# EAGLE design FLC-148 LED & Keypad panel (EAGLE 9.4.0)
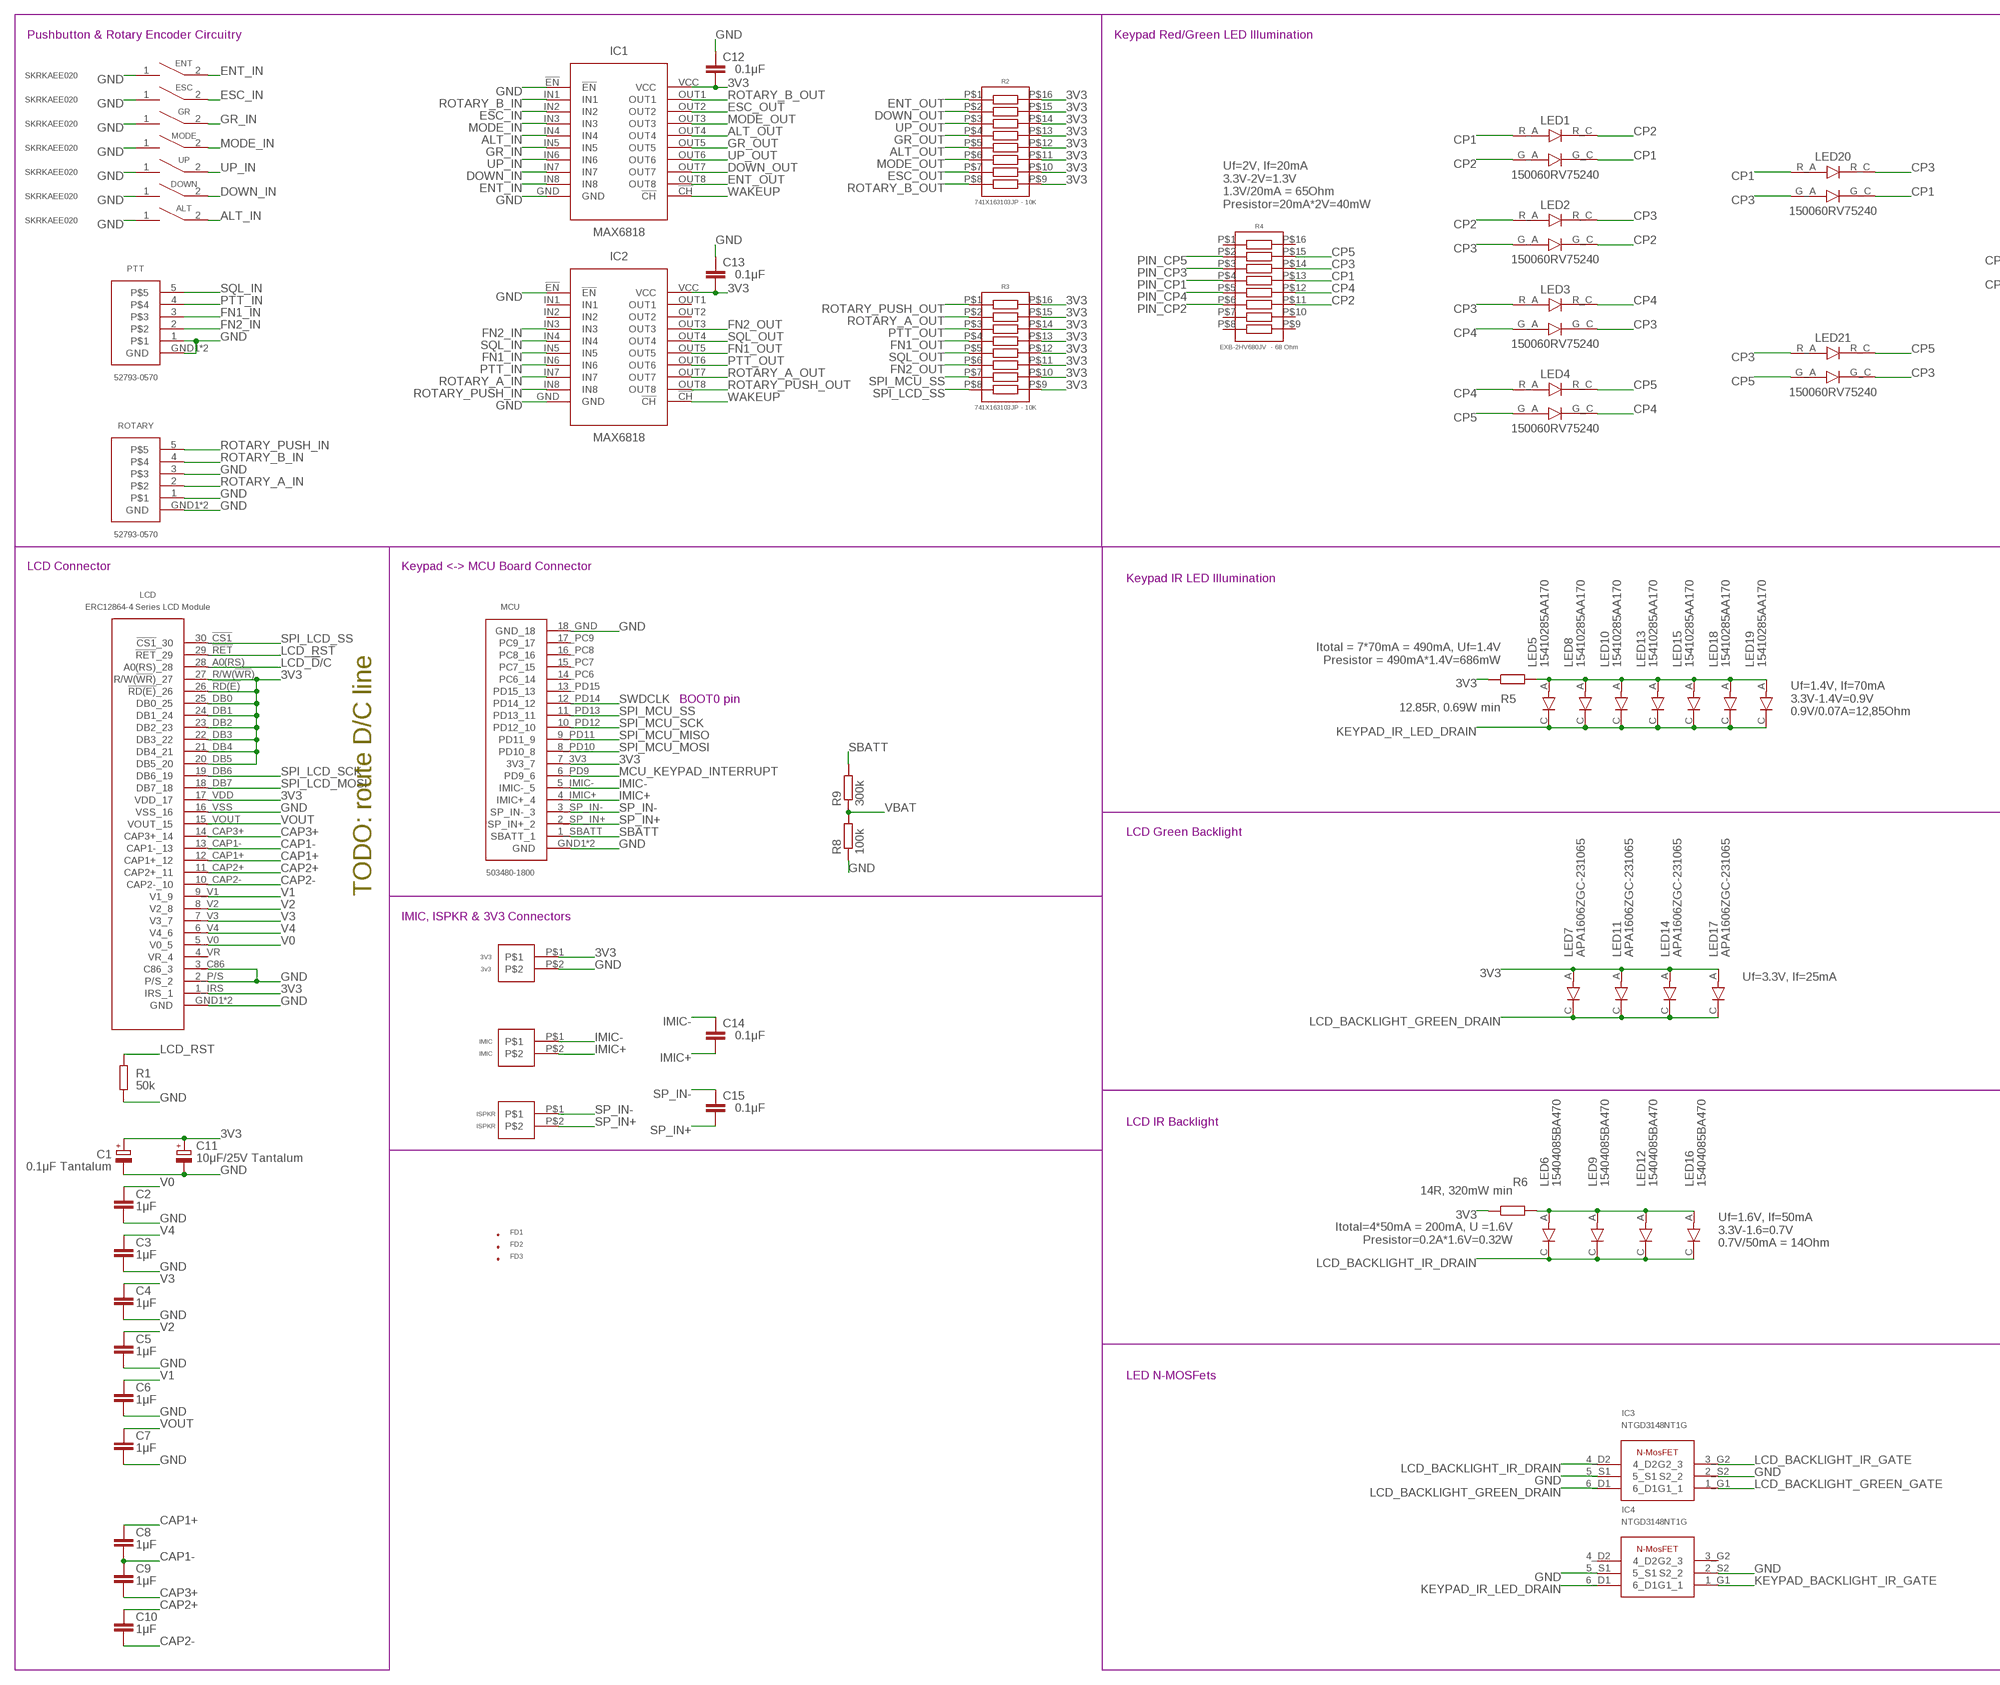
[diagram p0: schematic, sheet 1, part 1 of 2]
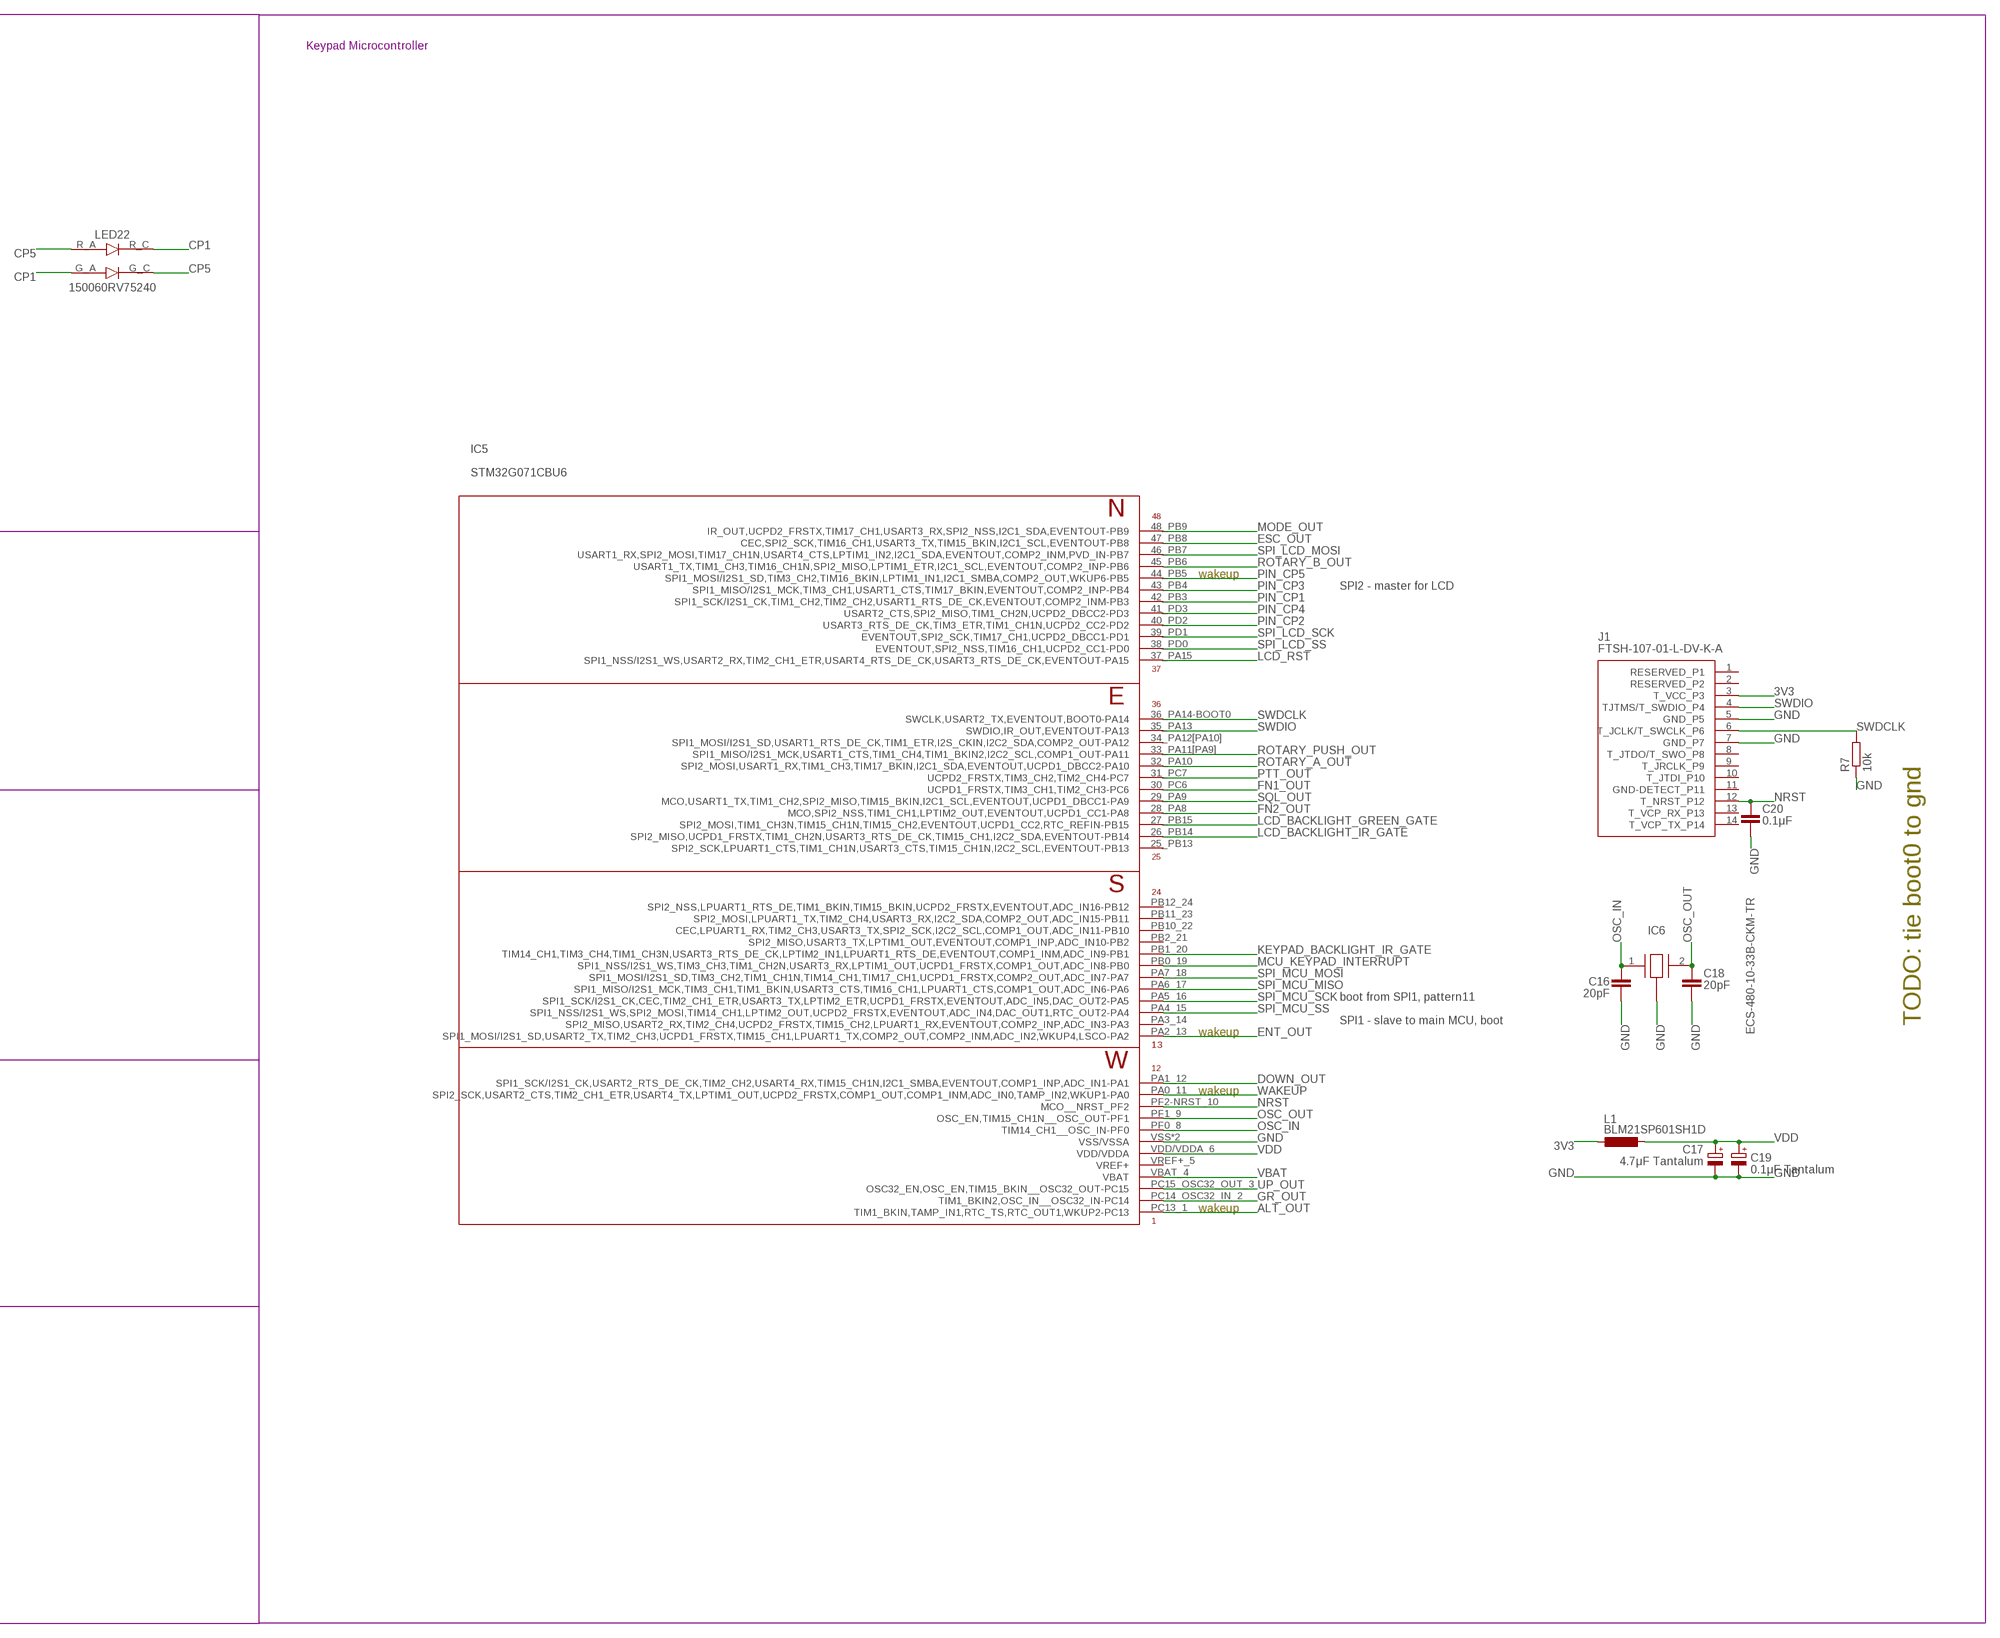
[diagram p1: schematic, sheet 1, part 2 of 2]

## Parts
3V3  3v3  2POLE_CONNECTOR  [SMD]
ALT  SKRKAEE020  [SMD]
C1  0.1μF Tantalum  CPOL-EUSMCA  [SMC_A]
C2  1μF  C-EUC0402  [C0402]
C3  1μF  C-EUC0402  [C0402]
C4  1μF  C-EUC0402  [C0402]
C5  1μF  C-EUC0402  [C0402]
C6  1μF  C-EUC0402  [C0402]
C7  1μF  C-EUC0402  [C0402]
C8  1μF  C-EUC0402  [C0402]
C9  1μF  C-EUC0402  [C0402]
C10  1μF  C-EUC0402  [C0402]
C11  10μF/25V Tantalum  CPOL-EUSMCB  [SMC_B]
C12  0.1μF  C-EUC0402  [C0402]
C13  0.1μF  C-EUC0402  [C0402]
C14  0.1μF  C-EUC0402  [C0402]
C15  0.1μF  C-EUC0402  [C0402]
C16  20pF  C-EUC0402  [C0402]
C17  4.7μF Tantalum  CPOL-EUSMCA  [SMC_A]
C18  20pF  C-EUC0402  [C0402]
C19  0.1μF Tantalum  CPOL-EUSMCA  [SMC_A]
C20  0.1μF  C-EUC0402  [C0402]
DOWN  SKRKAEE020  [SMD]
ENT  SKRKAEE020  [SMD]
ESC  SKRKAEE020  [SMD]
FD1  FID_20MIL_P  [FID_020_P]
FD2  FID_20MIL_P  [FID_020_P]
FD3  FID_20MIL_P  [FID_020_P]
GR  SKRKAEE020  [SMD]
IC1  MAX6818  [TSSOP20]
IC2  MAX6818  [TSSOP20]
IC3  NTGD3148NT1G  [TSOP-6]
IC4  NTGD3148NT1G  [TSOP-6]
IC5  STM32G071CBU6  [UFQFPN48]
IC6  ECS-480-10-33B-CKM-TR  [3.2X2.5MM]
IMIC  IMIC  2POLE_CONNECTOR  [SMD]
ISPKR  ISPKR  2POLE_CONNECTOR  [SMD]
J1  FTSH-107-01-L-DV-K-A  [FTSH10701LDVKA]
L1  BLM21SP601SH1D  L-EUL2012C  [L2012C]
LCD  ERC12864-4 Series LCD Module  ER-CON30HB-1  [SMD]
LED1  150060RV75240  WL-SBCC  [SMD]
LED2  150060RV75240  WL-SBCC  [SMD]
LED3  150060RV75240  WL-SBCC  [SMD]
LED4  150060RV75240  WL-SBCC  [SMD]
LED5  15410285AA170  [1002]
LED6  15404085BA470  [0402]
LED7  APA1606ZGC-231065  APA1606ZGC  [0605]
LED8  15410285AA170  [1002]
LED9  15404085BA470  [0402]
LED10  15410285AA170  [1002]
LED11  APA1606ZGC-231065  APA1606ZGC  [0605]
LED12  15404085BA470  [0402]
LED13  15410285AA170  [1002]
LED14  APA1606ZGC-231065  APA1606ZGC  [0605]
LED15  15410285AA170  [1002]
LED16  15404085BA470  [0402]
LED17  APA1606ZGC-231065  APA1606ZGC  [0605]
LED18  15410285AA170  [1002]
LED19  15410285AA170  [1002]
LED20  150060RV75240  WL-SBCC  [SMD]
LED21  150060RV75240  WL-SBCC  [SMD]
LED22  150060RV75240  WL-SBCC  [SMD]
MCU  503480-1800  5034801800-MOTHERBOARD<->LCD-PANEL  [5034801800-MOTHERBOARD<->LCD-PANEL]
MODE  SKRKAEE020  [SMD]
PTT  52793-0570  527930570  [SMD]
R1  50k  R-EU_R0402  [R0402]
R2  741X163103JP - 10K  741X163  [SMD]
R3  741X163103JP - 10K  741X163  [SMD]
R4  EXB-2HV680JV - 68 Ohm  741X163  [SMD]
R5  12.85R, 0.69W min  R-EU_R1206  [R1206]
R6  14R, 320mW min  R-EU_R0805  [R0805]
R7  10k  R-EU_R0402  [R0402]
R8  100k  R-EU_R0402  [R0402]
R9  300k  R-EU_R0402  [R0402]
ROTARY  52793-0570  527930570  [SMD]
UP  SKRKAEE020  [SMD]

## Nets
3V3 [Vcc]: 3V3.P$1 C1.+ C11.+ C12.2 C13.2 IC1.VCC IC2.VCC J1.3(T_VCC_P3) L1.2 LCD.1_IRS(IRS_1) LCD.17_VDD(VDD_17) LCD.20_DB5(DB5_20) LCD.21_DB4(DB4_21) LCD.22_DB3(DB3_22) LCD.23_DB2(DB2_23) LCD.24_DB1(DB1_24) LCD.25_DB0(DB0_25) LCD.26_!RD(E)!(!RD(E)!_26) LCD.27_R/W(!WR!)(R/W(!WR!)_27) LED7.A LED11.A LED14.A LED17.A MCU.7_3V3(3V3_7) R2.P$9 R2.P$10 R2.P$11 R2.P$12 R2.P$13 R2.P$14 R2.P$15 R2.P$16 R3.P$9 R3.P$10 R3.P$11 R3.P$12 R3.P$13 R3.P$14 R3.P$15 R3.P$16 R5.1 R6.1
ALT_IN [signal]: ALT.2 IC1.IN4
ALT_OUT [signal]: IC1.OUT4 IC5.PC13_1(TIM1_BKIN,TAMP_IN1,RTC_TS,RTC_OUT1,WKUP2-PC13) R2.P$5
CAP1+ [signal]: C8.1 LCD.12_CAP1+(CAP1+_12)
CAP1- [signal]: C8.2 C9.1 LCD.13_CAP1-(CAP1-_13)
CAP2+ [signal]: C10.1 LCD.11_CAP2+(CAP2+_11)
CAP2- [signal]: C10.2 LCD.10_CAP2-(CAP2-_10)
CAP3+ [signal]: C9.2 LCD.14_CAP3+(CAP3+_14)
CP1 [signal]: LED1.G_C LED1.R_A LED20.G_C LED20.R_A LED22.G_A LED22.R_C R4.P$13
CP2 [signal]: LED1.G_A LED1.R_C LED2.G_C LED2.R_A R4.P$11
CP3 [signal]: LED2.G_A LED2.R_C LED3.G_C LED3.R_A LED20.G_A LED20.R_C LED21.G_C LED21.R_A R4.P$14
CP4 [signal]: LED3.G_A LED3.R_C LED4.G_C LED4.R_A R4.P$12
CP5 [signal]: LED4.G_A LED4.R_C LED21.G_A LED21.R_C LED22.G_C LED22.R_A R4.P$15
DOWN_IN [signal]: DOWN.2 IC1.IN7
DOWN_OUT [signal]: IC1.OUT7 IC5.PA1_12(SPI1_SCK/I2S1_CK,USART2_RTS_DE_CK,TIM2_CH2,USART4_RX,TIM15_CH1N,I2C1_SMBA,EVENTOUT,COMP1_INP,ADC_IN1-PA1) R2.P$2
ENT_IN [signal]: ENT.2 IC1.IN8
ENT_OUT [signal]: IC1.OUT8 IC5.PA2_13(SPI1_MOSI/I2S1_SD,USART2_TX,TIM2_CH3,UCPD1_FRSTX,TIM15_CH1,LPUART1_TX,COMP2_OUT,COMP2_INM,ADC_IN2,WKUP4,LSCO-PA2) R2.P$1
ESC_IN [signal]: ESC.2 IC1.IN2
ESC_OUT [signal]: IC1.OUT2 IC5.47_PB8(CEC,SPI2_SCK,TIM16_CH1,USART3_TX,TIM15_BKIN,I2C1_SCL,EVENTOUT-PB8) R2.P$7
FN1_IN [signal]: IC2.IN5 PTT.3
FN1_OUT [signal]: IC2.OUT5 IC5.30_PC6(UCPD1_FRSTX,TIM3_CH1,TIM2_CH3-PC6) R3.P$4
FN2_IN [signal]: IC2.IN3 PTT.2
FN2_OUT [signal]: IC2.OUT3 IC5.28_PA8(MCO,SPI2_NSS,TIM1_CH1,LPTIM2_OUT,EVENTOUT,UCPD1_CC1-PA8) R3.P$6
GND: 3V3.P$2 ALT.1 C1.- C2.2 C3.2 C4.2 C5.2 C6.2 C7.2 C11.- C12.1 C13.1 C16.2 C17.- C18.2 C19.- C20.2 DOWN.1 ENT.1 ESC.1 GR.1 IC1.!EN! IC1.GND IC2.!EN! IC2.GND IC3.2_S2(S2_2) IC3.5_S1 IC4.2_S2(S2_2) IC4.5_S1 IC5.VSS(VSS/VSSA) IC5.VSS/VSSA_7(VSS/VSSA) IC6.GND1(GND) IC6.GND2(GND) J1.5(GND_P5) J1.7(GND_P7) LCD.2_P/S(P/S_2) LCD.3_C86(C86_3) LCD.16_VSS(VSS_16) LCD.GND1(GND) LCD.GND2(GND) MCU.18_GND(GND_18) MCU.GND1(GND) MCU.GND2(GND) MODE.1 PTT.1 PTT.GND1(GND) PTT.GND2(GND) R1.1 R7.1 R8.1 ROTARY.1 ROTARY.3 ROTARY.GND1(GND) ROTARY.GND2(GND) UP.1
GR_IN [signal]: GR.2 IC1.IN5
GR_OUT [signal]: IC1.OUT5 IC5.PC14_OSC32_IN_2(TIM1_BKIN2,OSC_IN__OSC32_IN-PC14) R2.P$4
IMIC+ [signal]: C14.2 IMIC.P$2 MCU.4_IMIC+(IMIC+_4)
IMIC- [signal]: C14.1 IMIC.P$1 MCU.5_IMIC-(IMIC-_5)
IR_ANODE [signal]: LED6.A LED9.A LED12.A LED16.A R6.2
KEYPAD_BACKLIGHT_IR_GATE [signal]: IC4.1_G1(G1_1) IC5.PB1_20(TIM14_CH1,TIM3_CH4,TIM1_CH3N,USART3_RTS_DE_CK,LPTIM2_IN1,LPUART1_RTS_DE,EVENTOUT,COMP1_INM,ADC_IN9-PB1)
KEYPAD_IR_LED_A [signal]: LED5.A LED8.A LED10.A LED13.A LED15.A LED18.A LED19.A R5.2
KEYPAD_IR_LED_DRAIN [signal]: IC4.6_D1 LED5.C LED8.C LED10.C LED13.C LED15.C LED18.C LED19.C
LCD_!D!/C [signal]: LCD.28_A0(RS)(A0(RS)_28)
LCD_BACKLIGHT_GREEN_DRAIN [signal]: IC3.6_D1 LED7.C LED11.C LED14.C LED17.C
LCD_BACKLIGHT_GREEN_GATE [signal]: IC3.1_G1(G1_1) IC5.27_PB15(SPI2_MOSI,TIM1_CH3N,TIM15_CH1N,TIM15_CH2,EVENTOUT,UCPD1_CC2,RTC_REFIN-PB15)
LCD_BACKLIGHT_IR_DRAIN [signal]: IC3.4_D2 LED6.C LED9.C LED12.C LED16.C
LCD_BACKLIGHT_IR_GATE [signal]: IC3.3_G2(G2_3) IC5.26_PB14(SPI2_MISO,UCPD1_FRSTX,TIM1_CH2N,USART3_RTS_DE_CK,TIM15_CH1,I2C2_SDA,EVENTOUT-PB14)
LCD_RST [signal]: IC5.37_PA15(SPI1_NSS/I2S1_WS,USART2_RX,TIM2_CH1_ETR,USART4_RTS_DE_CK,USART3_RTS_DE_CK,EVENTOUT-PA15) LCD.29_!RET!(!RET!_29) R1.2
MCU_KEYPAD_INTERRUPT [signal]: IC5.PB0_19(SPI1_NSS/I2S1_WS,TIM3_CH3,TIM1_CH2N,USART3_RX,LPTIM1_OUT,UCPD1_FRSTX,COMP1_OUT,ADC_IN8-PB0) MCU.6_PD9(PD9_6)
MODE_IN [signal]: IC1.IN3 MODE.2
MODE_OUT [signal]: IC1.OUT3 IC5.48_PB9(IR_OUT,UCPD2_FRSTX,TIM17_CH1,USART3_RX,SPI2_NSS,I2C1_SDA,EVENTOUT-PB9) R2.P$6
NRST [signal]: C20.1 IC5.PF2-NRST_10(MCO__NRST_PF2) J1.12(T_NRST_P12)
OSC_IN [signal]: C16.1 IC5.PF0_8(TIM14_CH1__OSC_IN-PF0) IC6.1
OSC_OUT [signal]: C18.1 IC5.PF1_9(OSC_EN,TIM15_CH1N__OSC_OUT-PF1) IC6.2
PIN_CP1 [signal]: IC5.42_PB3(SPI1_SCK/I2S1_CK,TIM1_CH2,TIM2_CH2,USART1_RTS_DE_CK,EVENTOUT,COMP2_INM-PB3) R4.P$4
PIN_CP2 [signal]: IC5.40_PD2(USART3_RTS_DE_CK,TIM3_ETR,TIM1_CH1N,UCPD2_CC2-PD2) R4.P$6
PIN_CP3 [signal]: IC5.43_PB4(SPI1_MISO/I2S1_MCK,TIM3_CH1,USART1_CTS,TIM17_BKIN,EVENTOUT,COMP2_INP-PB4) R4.P$3
PIN_CP4 [signal]: IC5.41_PD3(USART2_CTS,SPI2_MISO,TIM1_CH2N,UCPD2_DBCC2-PD3) R4.P$5
PIN_CP5 [signal]: IC5.44_PB5(SPI1_MOSI/I2S1_SD,TIM3_CH2,TIM16_BKIN,LPTIM1_IN1,I2C1_SMBA,COMP2_OUT,WKUP6-PB5) R4.P$2
PTT_IN [signal]: IC2.IN6 PTT.4
PTT_OUT [signal]: IC2.OUT6 IC5.31_PC7(UCPD2_FRSTX,TIM3_CH2,TIM2_CH4-PC7) R3.P$3
ROTARY_A_IN [signal]: IC2.IN7 ROTARY.2
ROTARY_A_OUT [signal]: IC2.OUT7 IC5.32_PA10(SPI2_MOSI,USART1_RX,TIM1_CH3,TIM17_BKIN,I2C1_SDA,EVENTOUT,UCPD1_DBCC2-PA10) R3.P$2
ROTARY_B_IN [signal]: IC1.IN1 ROTARY.4
ROTARY_B_OUT [signal]: IC1.OUT1 IC5.45_PB6(USART1_TX,TIM1_CH3,TIM16_CH1N,SPI2_MISO,LPTIM1_ETR,I2C1_SCL,EVENTOUT,COMP2_INP-PB6) R2.P$8
ROTARY_PUSH_IN [signal]: IC2.IN8 ROTARY.5
ROTARY_PUSH_OUT [signal]: IC2.OUT8 IC5.33_PA11[PA9](SPI1_MISO/I2S1_MCK,USART1_CTS,TIM1_CH4,TIM1_BKIN2,I2C2_SCL,COMP1_OUT-PA11) R3.P$1
SBATT [Vcc]: MCU.1_SBATT(SBATT_1) R9.2
SP_IN+ [signal]: C15.2 ISPKR.P$2 MCU.2_SP_IN+(SP_IN+_2)
SP_IN- [signal]: C15.1 ISPKR.P$1 MCU.3_SP_IN-(SP_IN-_3)
SPI_LCD_MOSI [signal]: IC5.46_PB7(USART1_RX,SPI2_MOSI,TIM17_CH1N,USART4_CTS,LPTIM1_IN2,I2C1_SDA,EVENTOUT,COMP2_INM,PVD_IN-PB7) LCD.18_DB7(DB7_18)
SPI_LCD_SCK [signal]: IC5.39_PD1(EVENTOUT,SPI2_SCK,TIM17_CH1,UCPD2_DBCC1-PD1) LCD.19_DB6(DB6_19)
SPI_LCD_SS [signal]: IC5.38_PD0(EVENTOUT,SPI2_NSS,TIM16_CH1,UCPD2_CC1-PD0) LCD.30_!CS1!(!CS1!_30) R3.P$8
SPI_MCU_MISO [signal]: IC5.PA6_17(SPI1_MISO/I2S1_MCK,TIM3_CH1,TIM1_BKIN,USART3_CTS,TIM16_CH1,LPUART1_CTS,COMP1_OUT,ADC_IN6-PA6) MCU.9_PD11(PD11_9)
SPI_MCU_MOSI [signal]: IC5.PA7_18(SPI1_MOSI/I2S1_SD,TIM3_CH2,TIM1_CH1N,TIM14_CH1,TIM17_CH1,UCPD1_FRSTX,COMP2_OUT,ADC_IN7-PA7) MCU.8_PD10(PD10_8)
SPI_MCU_SCK [signal]: IC5.PA5_16(SPI1_SCK/I2S1_CK,CEC,TIM2_CH1_ETR,USART3_TX,LPTIM2_ETR,UCPD1_FRSTX,EVENTOUT,ADC_IN5,DAC_OUT2-PA5) MCU.10_PD12(PD12_10)
SPI_MCU_SS [signal]: IC5.PA4_15(SPI1_NSS/I2S1_WS,SPI2_MOSI,TIM14_CH1,LPTIM2_OUT,UCPD2_FRSTX,EVENTOUT,ADC_IN4,DAC_OUT1,RTC_OUT2-PA4) MCU.11_PD13(PD13_11) R3.P$7
SQL_IN [signal]: IC2.IN4 PTT.5
SQL_OUT [signal]: IC2.OUT4 IC5.29_PA9(MCO,USART1_TX,TIM1_CH2,SPI2_MISO,TIM15_BKIN,I2C1_SCL,EVENTOUT,UCPD1_DBCC1-PA9) R3.P$5
SWDCLK [signal]: IC5.36_PA14-BOOT0(SWCLK,USART2_TX,EVENTOUT,BOOT0-PA14) J1.6(T_JCLK/T_SWCLK_P6) MCU.12_PD14(PD14_12) R7.2
SWDIO [signal]: IC5.35_PA13(SWDIO,IR_OUT,EVENTOUT-PA13) J1.4(TJTMS/T_SWDIO_P4)
UP_IN [signal]: IC1.IN6 UP.2
UP_OUT [signal]: IC1.OUT6 IC5.PC15_OSC32_OUT_3(OSC32_EN,OSC_EN,TIM15_BKIN__OSC32_OUT-PC15) R2.P$3
V0 [signal]: C2.1 LCD.5_V0(V0_5)
V1 [signal]: C6.1 LCD.9_V1(V1_9)
V2 [signal]: C5.1 LCD.8_V2(V2_8)
V3 [signal]: C4.1 LCD.7_V3(V3_7)
V4 [signal]: C3.1 LCD.6_V4(V4_6)
VBAT: IC5.VBAT_4(VBAT) R8.2 R9.1
VDD [Vcc]: C17.+ C19.+ IC5.VDD/VDDA_6(VDD/VDDA) L1.1
VOUT [signal]: C7.1 LCD.15_VOUT(VOUT_15)
WAKEUP [signal]: IC1.!CH! IC2.!CH! IC5.PA0_11(SPI2_SCK,USART2_CTS,TIM2_CH1_ETR,USART4_TX,LPTIM1_OUT,UCPD2_FRSTX,COMP1_OUT,COMP1_INM,ADC_IN0,TAMP_IN2,WKUP1-PA0)
Unconnected: IC2.IN1 IC2.IN2 IC2.OUT1 IC2.OUT2 IC4.3_G2(G2_3) IC4.4_D2 IC5.25_PB13(SPI2_SCK,LPUART1_CTS,TIM1_CH1N,USART3_CTS,TIM15_CH1N,I2C2_SCL,EVENTOUT-PB13) IC5.34_PA12[PA10](SPI1_MOSI/I2S1_SD,USART1_RTS_DE_CK,TIM1_ETR,I2S_CKIN,I2C2_SDA,COMP2_OUT-PA12) IC5.PA3_14(SPI2_MISO,USART2_RX,TIM2_CH4,UCPD2_FRSTX,TIM15_CH2,LPUART1_RX,EVENTOUT,COMP2_INP,ADC_IN3-PA3) IC5.PB2_21(SPI2_MISO,USART3_TX,LPTIM1_OUT,EVENTOUT,COMP1_INP,ADC_IN10-PB2) IC5.PB10_22(CEC,LPUART1_RX,TIM2_CH3,USART3_TX,SPI2_SCK,I2C2_SCL,COMP1_OUT,ADC_IN11-PB10) IC5.PB11_23(SPI2_MOSI,LPUART1_TX,TIM2_CH4,USART3_RX,I2C2_SDA,COMP2_OUT,ADC_IN15-PB11) IC5.PB12_24(SPI2_NSS,LPUART1_RTS_DE,TIM1_BKIN,TIM15_BKIN,UCPD2_FRSTX,EVENTOUT,ADC_IN16-PB12) IC5.VREF+_5(VREF+) J1.1(RESERVED_P1) J1.2(RESERVED_P2) J1.8(T_JTDO/T_SWO_P8) J1.9(T_JRCLK_P9) J1.10(T_JTDI_P10) J1.11(GND-DETECT_P11) J1.13(T_VCP_RX_P13) J1.14(T_VCP_TX_P14) LCD.4_VR(VR_4) MCU.13_PD15(PD15_13) MCU.14_PC6(PC6_14) MCU.15_PC7(PC7_15) MCU.16_PC8(PC8_16) MCU.17_PC9(PC9_17) R4.P$1 R4.P$7 R4.P$8 R4.P$9 R4.P$10 R4.P$16

## Notes on the sheet
- Pushbutton & Rotary Encoder Circuitry | Keypad Red/Green LED Illumination
- Keypad Microcontroller
- Uf=2V, If=20mA
  3.3V-2V=1.3V
  1.3V/20mA = 65Ohm
  Presistor=20mA*2V=40mW
- LCD Connector | Keypad <-> MCU Board Connector
- Keypad IR LED Illumination
- wakeup
- SPI2 - master for LCD
- Itotal = 7*70mA = 490mA, Uf=1.4V
  Presistor = 490mA*1.4V=686mW
- TODO: route D/C line
- BOOT0 pin
- Uf=1.4V, If=70mA
  3.3V-1.4V=0.9V
  0.9V/0.07A=12,85Ohm
- TODO: tie boot0 to gnd
- LCD Green Backlight
- IMIC, ISPKR & 3V3 Connectors
- Uf=3.3V, If=25mA
- boot from SPI1, pattern11
- SPI1 - slave to main MCU, boot
- wakeup
- LCD IR Backlight | wakeup
- Itotal=4*50mA = 200mA, U =1.6V
  Presistor=0.2A*1.6V=0.32W
- Uf=1.6V, If=50mA
  3.3V-1.6=0.7V
  0.7V/50mA = 14Ohm
- wakeup
- LED N-MOSFets

## Library data of the parts
3V3 IMIC ISPKR = 2-Pole Connector:2POLE_CONNECTOR
ALT DOWN ENT ESC GR MODE UP = SKRKAEE020 TACT Pushbutton:SKRKAEE020
C1 C11 C17 C19 = rcl:CPOL-EU: POLARIZED CAPACITOR, European symbol; SPICEPREFIX: C
C2-C10 C12-C16 C18 C20 = rcl:C-EU: CAPACITOR, European symbol; SPICEPREFIX: C
FD1-FD3 = Fiducial:FID: Fiducial marks. Top and Bottom copper with stop mask
IC1 IC2 = MAX6818 CMOS Switch debouncer:MAX6818
IC3 IC4 = NTGD3148NT1G - dual N-Fet:NTGD3148NT1G
IC5 = STM32G071CBU6 Microcontroller:STM32G071CBU6
IC6 = ECS-480-10-33B-CKM-TR 48MHz Crystal:ECS-480-10-33B-CKM-TR
J1 = STM32 JTAG 1.27mm 14pin header:FTSH-107-01-L-DV-K-A: Headers & Wire Housings .050" Micro Terminal Strip Source: Datasheet <https://componentsearchengine.com/Datasheets/1/FTSH-107-01-L-DV-K-A.pdf>; DESCRIPTION: Headers & Wire Housings .050" Micro Terminal Strip; HEIGHT: 5.97mm; MANUFACTURER_NAME: SAMTEC; MANUFACTURER_PART_NUMBER: FTSH-107-01-L-DV-K-A; MOUSER_PART_NUMBER: 200-FTSH10701LDVKA; MOUSER_PRICE-STOCK: https://www.mouser.com/Search/Refine.aspx?Keyword=200-FTSH10701LDVKA
L1 = rcl:L-EU: INDUCTOR, European symbol; SPICEPREFIX: L
LCD = ER-CON30HB-1 FFC Connector 30p 0.5mm Pitch.pdf:ER-CON30HB-1
LED1-LED4 LED20-LED22 = 150060RV75240 WL-SBCC Bi-Color LED:WL-SBCC
LED5 LED8 LED10 LED13 LED15 LED18 LED19 = 15410285AA170 IR LED:15410285AA170
LED6 LED9 LED12 LED16 = 15404085BA470 IR LED:15404085BA470
LED7 LED11 LED14 LED17 = APA1606ZGC Green LED:APA1606ZGC
MCU = 5034801800 FFC Connector 19p 0.5mm Pitch, FLC148 Motherboard - LCD Panel:5034801800-MOTHERBOARD<->LCD-PANEL
PTT ROTARY = 527930570 FFC Connector 5p 1mm Pitch:527930570
R1 R5-R9 = rcl:R-EU_: RESISTOR, European symbol; SPICEPREFIX: R
R2-R4 = 741X163103JP 10k Ohm Resistor Array:741X163

## Net classes
0 GND: width 0.3 mm, drill 0.35 mm, clearance 0.2 mm
1 Vcc: width 0.3 mm, drill 0.35 mm, clearance 0.2 mm
2 signal: width 0.25 mm, drill 0.35 mm, clearance 0.2 mm

## Board
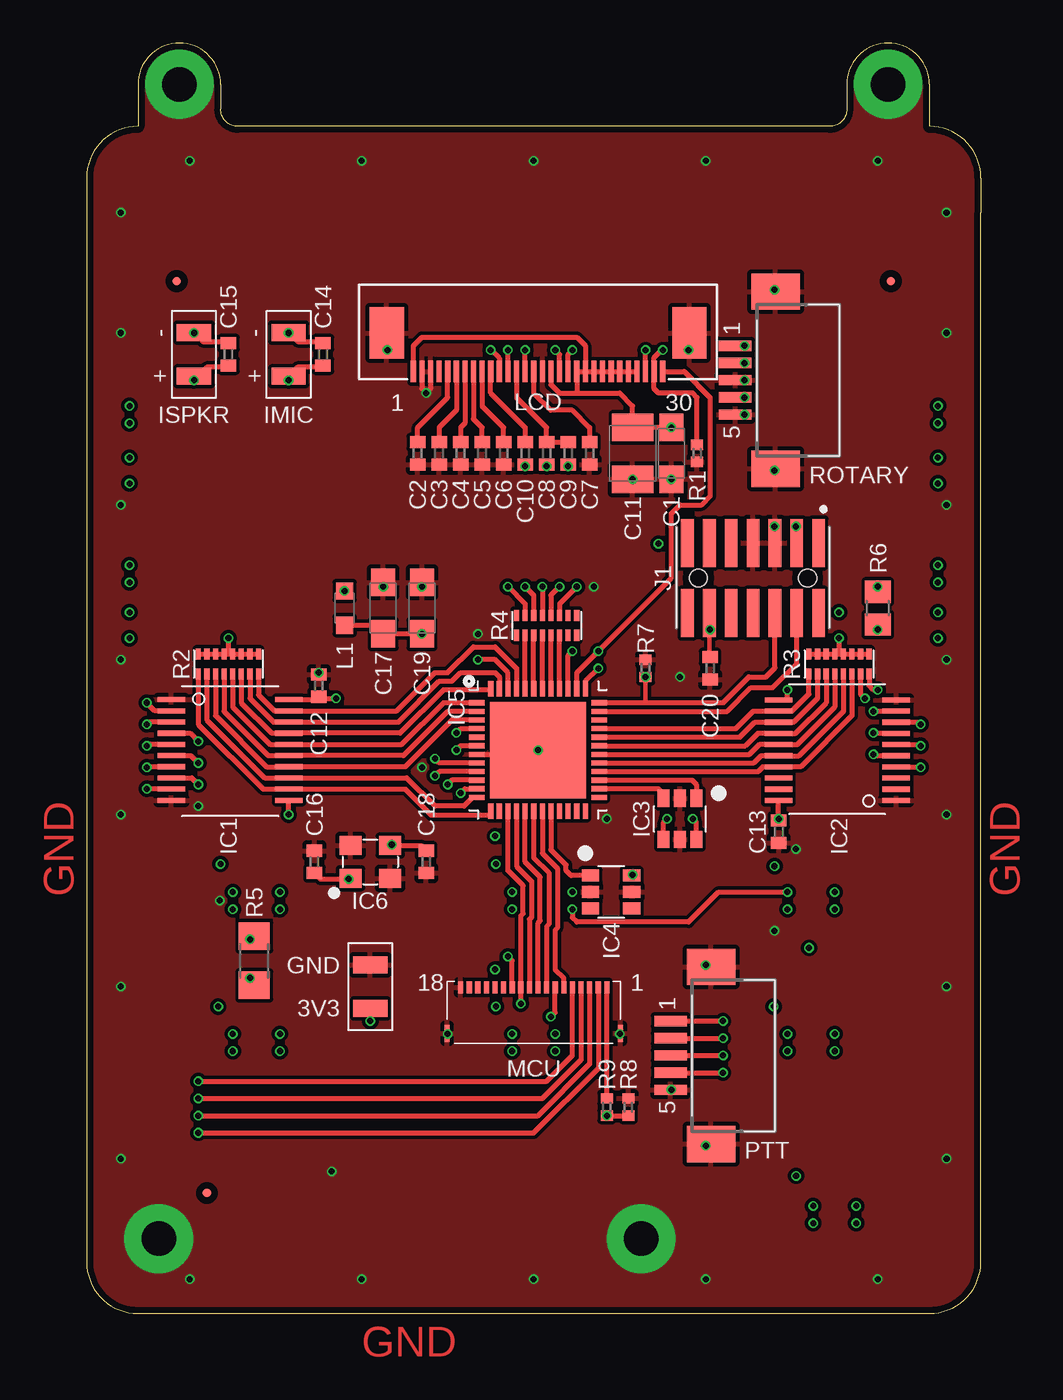
[diagram p2: board, top side]
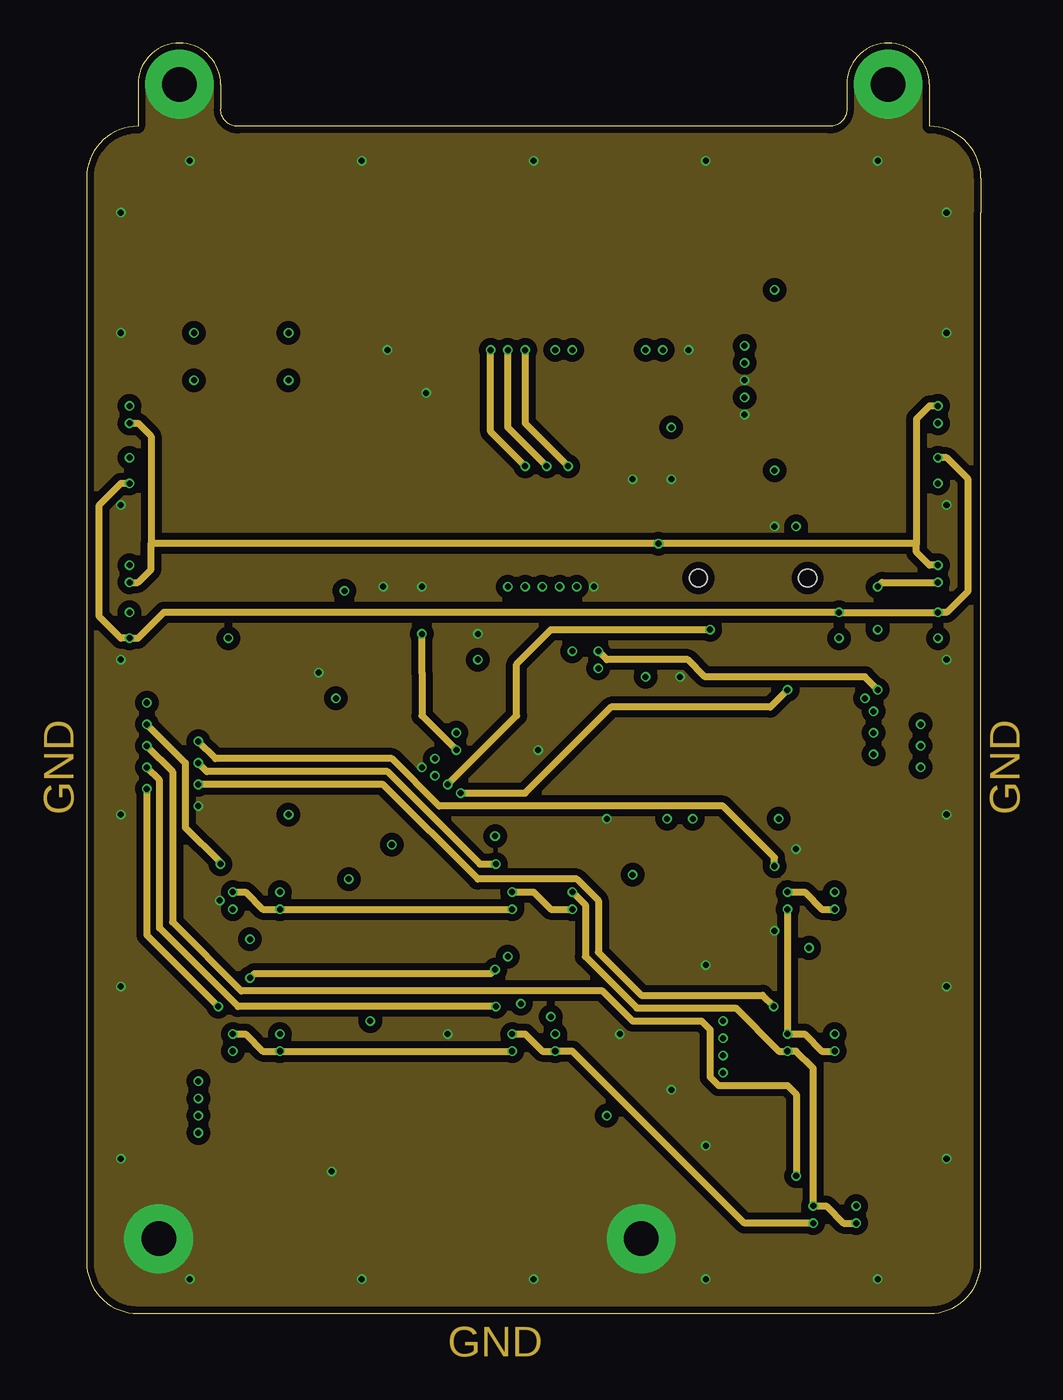
[diagram p3: board, inner layer Route2]
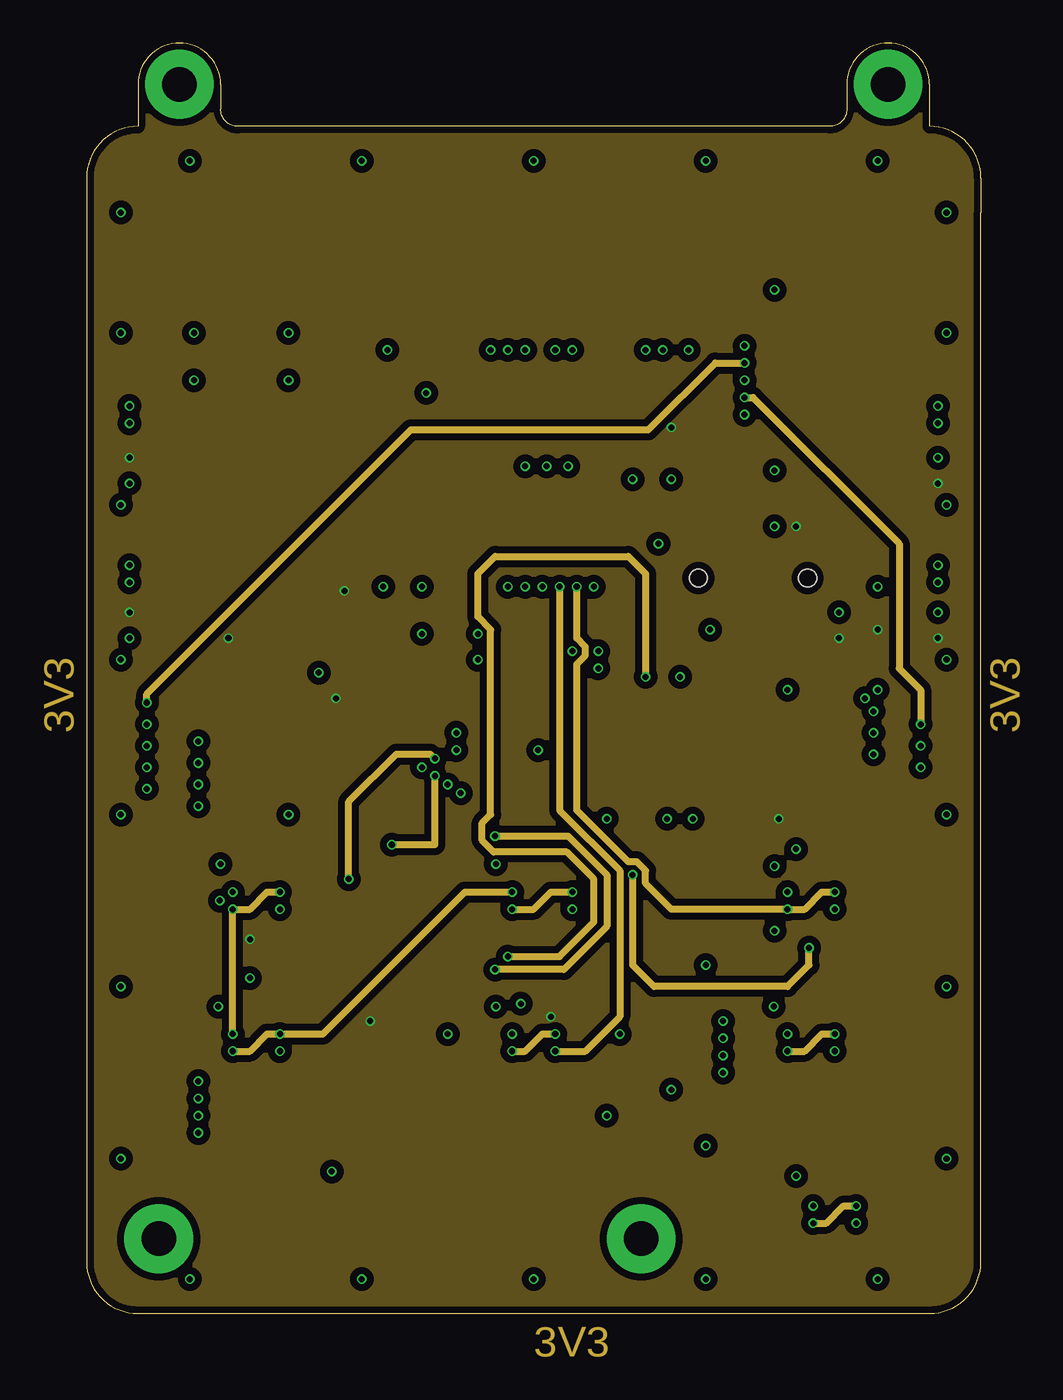
[diagram p4: board, inner layer Route15]
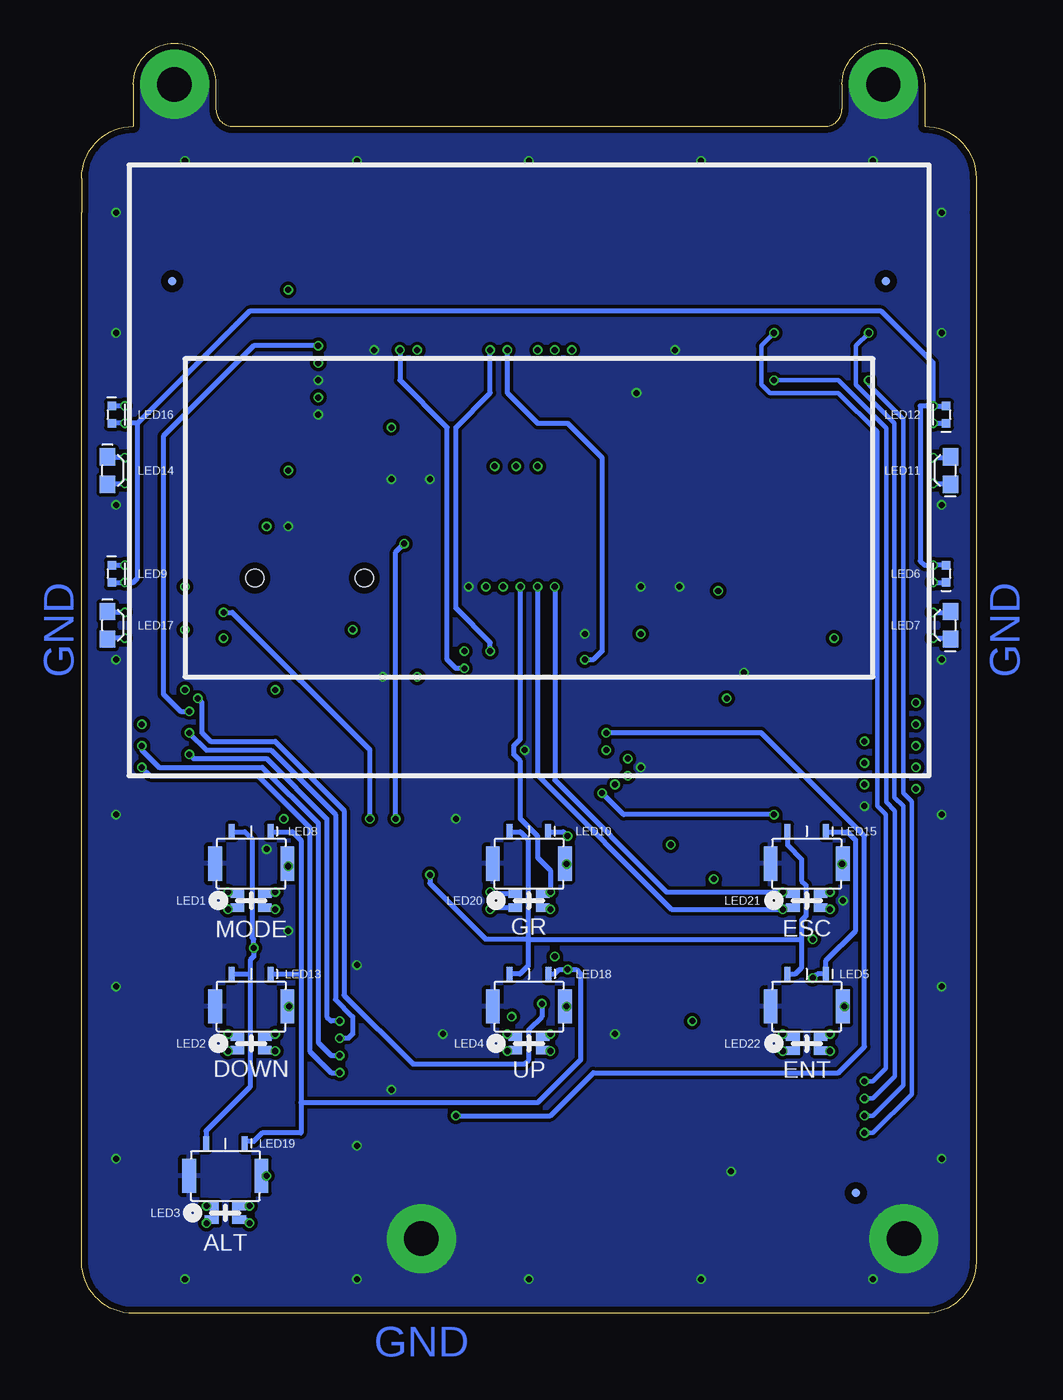
[diagram p5: board, bottom side, seen from below]

Size 52 x 73.85 mm. Coordinates in mm from the lower left corner, seen from the top.
Outline: 0,64 0,3 arc90 3,0 49,0 arc90 52,3 52,64 52,66 arc90 49,69 49,71.45 arc90 46.6,73.85 arc90 44.2,71.45 44.2,70 arc-90 43.2,69 8.8,69 arc-90 7.8,70 7.8,71.45 arc90 5.4,73.85 arc90 3,71.45 3,69 arc90 0,66 0,64
Copper layers (1*2*15*16): Top 0.035559375mm / dielectric 0.17018125mm / Route2 0.01778125mm / dielectric 47mil / Route15 0.01778125mm / dielectric 0.17018125mm / Bottom 0.035559375mm
Design rules "oshpark-4layer": minimum track width 5mil, minimum drill 10mil, track to track 5mil, track to pad 5mil, pad to pad 5mil, via to via 5mil, smd to smd 5mil, copper to edge 15mil, drill to drill 6mil, minimum pad ring 4mil, minimum via ring 4mil, stop-mask expansion 2.5mil, vias tented up to drill 0mil, thermal gap 10mil
tRestrict: 5 lines

### Footprints (pad centres in the part's own frame; a part is rotated, then mirrored left to right if it is on the bottom)
SMD = smd 2 x 1: P$1 0,1.27; P$2 0,-1.27
SMD' = smd 0.8 x 2: 1 -2.1,0; 2 2.1,0
SMC_A = smd 1.6 x 1.4: + -1.5,0; - 1.5,0
C0402 = smd 0.7 x 0.9: 1 -0.65,0; 2 0.65,0
SMC_B = smd 1.6 x 2.4: + -1.5,0; - 1.5,0
FID_020_P = smd 0.508 x 0.508 bottom: FIDB 0,0 | smd 0.508 x 0.508: FIDT 0,0
TSSOP20 = smd 0.3 x 1.6: !CH! 2.92,3.525; !EN! -2.93,-3.325; GND 2.92,-3.325; IN1 -2.28,-3.325; IN2 -1.63,-3.325; IN3 -0.98,-3.325; IN4 -0.33,-3.325; IN5 0.32,-3.325; IN6 0.97,-3.325; IN7 1.62,-3.325; IN8 2.27,-3.325; OUT1 -2.28,3.525; OUT2 -1.63,3.525; OUT3 -0.98,3.525; OUT4 -0.33,3.525; OUT5 0.32,3.525; OUT6 0.97,3.525; OUT7 1.62,3.525; OUT8 2.27,3.525; VCC -2.93,3.525
TSOP-6 = smd 0.7 x 1: 1_G1 -0.95,-1.2; 2_S2 0,-1.2; 3_G2 0.95,-1.2; 4_D2 0.95,1.2; 5_S1 0,1.2; 6_D1 -0.95,1.2
UFQFPN48 = smd 0.9 x 0.3: 25_PB13 3.55,-2.75; 26_PB14 3.55,-2.25; 27_PB15 3.55,-1.75; 28_PA8 3.55,-1.25; 29_PA9 3.55,-0.75; 30_PC6 3.55,-0.25; 31_PC7 3.55,0.25; 32_PA10 3.55,0.75; 33_PA11[PA9] 3.55,1.25; 34_PA12[PA10] 3.55,1.75; 35_PA13 3.55,2.25; 36_PA14-BOOT0 3.55,2.75; PA0_11 -3.55,-2.25; PA1_12 -3.55,-2.75; PC13_1 -3.55,2.75; PC14_OSC32_IN_2 -3.55,2.25; PC15_OSC32_OUT_3 -3.55,1.75; PF0_8 -3.55,-0.75; PF1_9 -3.55,-1.25; PF2-NRST_10 -3.55,-1.75; VBAT_4 -3.55,1.25; VDD/VDDA_6 -3.55,0.25; VREF+_5 -3.55,0.75; VSS/VSSA_7 -3.55,-0.25 | smd 0.3 x 0.9: 37_PA15 2.75,3.55; 38_PD0 2.25,3.55; 39_PD1 1.75,3.55; 40_PD2 1.25,3.55; 41_PD3 0.75,3.55; 42_PB3 0.25,3.55; 43_PB4 -0.25,3.55; 44_PB5 -0.75,3.55; 45_PB6 -1.25,3.55; 46_PB7 -1.75,3.55; 47_PB8 -2.25,3.55; 48_PB9 -2.75,3.55; PA2_13 -2.75,-3.55; PA3_14 -2.25,-3.55; PA4_15 -1.75,-3.55; PA5_16 -1.25,-3.55; PA6_17 -0.75,-3.55; PA7_18 -0.25,-3.55; PB0_19 0.25,-3.55; PB1_20 0.75,-3.55; PB2_21 1.25,-3.55; PB10_22 1.75,-3.55; PB11_23 2.25,-3.55; PB12_24 2.75,-3.55 | smd 5.6 x 5.6: VSS 0,0
3.2X2.5MM = smd 1.3 x 1.1: 1 -1.15,-0.95; 2 1.15,0.95; GND1 -1.15,0.95; GND2 1.15,-0.95
FTSH10701LDVKA = smd 0.74 x 2.79: 1 -3.81,-2.035; 2 -3.81,2.035; 3 -2.54,-2.035; 4 -2.54,2.035; 5 -1.27,-2.035; 6 -1.27,2.035; 7 0,-2.035; 8 0,2.035; 9 1.27,-2.035; 10 1.27,2.035; 11 2.54,-2.035; 12 2.54,2.035; 13 3.81,-2.035; 14 3.81,2.035 | hole 1.02: -3.175,0; 3.175,0
L2012C = smd 1 x 1: 1 -1,0; 2 1,0
SMD'' = smd 0.3 x 1.25: 1_IRS 7.25,0.743; 2_P/S 6.75,0.743; 3_C86 6.25,0.743; 4_VR 5.75,0.743; 5_V0 5.25,0.743; 6_V4 4.75,0.743; 7_V3 4.25,0.743; 8_V2 3.75,0.743; 9_V1 3.25,0.743; 10_CAP2- 2.75,0.743; 11_CAP2+ 2.25,0.743; 12_CAP1+ 1.75,0.743; 13_CAP1- 1.25,0.743; 14_CAP3+ 0.75,0.743; 15_VOUT 0.25,0.743; 16_VSS -0.25,0.743; 17_VDD -0.75,0.743; 18_DB7 -1.25,0.743; 19_DB6 -1.75,0.743; 20_DB5 -2.25,0.743; 21_DB4 -2.75,0.743; 22_DB3 -3.25,0.743; 23_DB2 -3.75,0.743; 24_DB1 -4.25,0.743; 25_DB0 -4.75,0.743; 26_!RD(E)! -5.25,0.743; 27_R/W(!WR!) -5.75,0.743; 28_A0(RS) -6.25,0.743; 29_!RET! -6.75,0.743; 30_!CS1! -7.25,0.743 | smd 2 x 3: GND1 -8.8,-1.5; GND2 8.8,-1.5
SMD''' = smd 0.8 x 0.5: G_A 0.8,-0.4; G_C -0.8,-0.4; R_A 0.8,0.4; R_C -0.8,0.4
1002 = smd 0.35 x 0.84: A 1.123,0.002; C -1.123,-0.002
0402 = smd 0.5 x 0.5: A 0.5,0; C -0.5,0
0605 = smd 1 x 0.9: A 0.8,0; C -0.8,0
5034801800-MOTHERBOARD<->LCD-PANEL = smd 0.3 x 0.7: 1_SBATT 4.25,2.21; 2_SP_IN+ 3.75,2.21; 3_SP_IN- 3.25,2.21; 4_IMIC+ 2.75,2.21; 5_IMIC- 2.25,2.21; 6_PD9 1.75,2.21; 7_3V3 1.25,2.21; 8_PD10 0.75,2.21; 9_PD11 0.25,2.21; 10_PD12 -0.25,2.21; 11_PD13 -0.75,2.21; 12_PD14 -1.25,2.21; 13_PD15 -1.75,2.21; 14_PC6 -2.25,2.21; 15_PC7 -2.75,2.21; 16_PC8 -3.25,2.21; 17_PC9 -3.75,2.21; 18_GND -4.25,2.21 | smd 0.3 x 1: GND1 -5.04,-0.46; GND2 5.04,-0.46
SMD'''' = smd 0.6 x 1.9: 1 -2,3.79; 2 -1,3.79; 3 0,3.79; 4 1,3.79; 5 2,3.79 | smd 2.1 x 2.8: GND1 -5.15,1.44; GND2 5.15,1.44
R0402 = smd 0.6 x 0.7: 1 -0.5,0; 2 0.5,0
SMD''''' = smd 0.3 x 0.65: P$1 -1.75,-0.575; P$2 -1.25,-0.575; P$3 -0.75,-0.575; P$4 -0.25,-0.575; P$5 0.25,-0.575; P$6 0.75,-0.575; P$7 1.25,-0.575; P$8 1.75,-0.575; P$9 1.75,0.575; P$10 1.25,0.575; P$11 0.75,0.575; P$12 0.25,0.575; P$13 -0.25,0.575; P$14 -0.75,0.575; P$15 -1.25,0.575; P$16 -1.75,0.575
R1206 = smd 1.6 x 1.803: 1 -1.422,0; 2 1.422,0
R0805 = smd 1.3 x 1.5: 1 -0.95,0; 2 0.95,0

### Placement (x,y rotation side)
3V3  16.5,19 180 top
ALT  SKRKAEE020  [SMD']  43.65,8 0 bottom
C1  34,50 270 top
C2  19.25,50 270 top
C3  20.5,50 270 top
C4  21.75,50 270 top
C5  23,50 270 top
C6  24.25,50 270 top
C7  29.25,50 270 top
C8  26.75,50 90 top
C9  28,50 270 top
C10  25.5,50 90 top
C11  31.75,50 270 top
C12  13.5,36.5 270 top
C13  40.25,28 90 top
C14  13.75,55.75 270 top
C15  8.25,55.75 270 top
C16  13.25,26.25 90 top
C17  17.25,41 90 top
C18  19.75,26.25 270 top
C19  19.5,41 90 top
C20  36.25,37.5 270 top
DOWN  SKRKAEE020  [SMD']  42.15,17.85 0 bottom
ENT  SKRKAEE020  [SMD']  9.85,17.85 0 bottom
ESC  SKRKAEE020  [SMD']  9.85,26.15 0 bottom
FD1  7,7 0 top
FD2  46.75,60 0 top
FD3  5.25,60 0 top
GR  SKRKAEE020  [SMD']  26,26.15 0 bottom
IC1  8.25,32.75 270 top
IC2  43.75,32.75 90 top
IC3  34.5,28.75 180 top
IC4  30.5,24.5 270 top
IC5  26.25,32.75 0 top
IC6  16.5,26.25 0 top
IMIC  11.75,55.75 0 top
ISPKR  6.25,55.75 0 top
J1  38.75,42.75 180 top
L1  15,41 90 top
LCD  ERC12864-4 Series LCD Module  [SMD'']  26.25,55.5 180 top
LED1  150060RV75240  [SMD''']  42.15,24 0 bottom
LED2  150060RV75240  [SMD''']  42.15,15.7 0 bottom
LED3  150060RV75240  [SMD''']  43.65,5.85 0 bottom
LED4  150060RV75240  [SMD''']  26,15.7 0 bottom
LED5  9.85,19.73 0 bottom
LED6  1.75,43 90 bottom
LED7  1.5,40 90 bottom
LED8  42.15,28.03 0 bottom
LED9  50.25,43 270 bottom
LED10  26,28.04 0 bottom
LED11  1.5,49 90 bottom
LED12  1.75,52.25 90 bottom
LED13  42.15,19.73 0 bottom
LED14  50.5,49 270 bottom
LED15  9.85,28.03 0 bottom
LED16  50.25,52.25 270 bottom
LED17  50.5,40 270 bottom
LED18  26,19.73 0 bottom
LED19  43.65,9.88 0 bottom
LED20  150060RV75240  [SMD''']  26,24 0 bottom
LED21  150060RV75240  [SMD''']  9.85,24 0 bottom
LED22  150060RV75240  [SMD''']  9.85,15.69 0 bottom
MCU  26,16.75 0 top
MODE  SKRKAEE020  [SMD']  42.15,26.15 0 bottom
PTT  52793-0570  [SMD'''']  37.75,15 90 top
R1  35.5,50 90 top
R2  741X163103JP - 10K  [SMD''''']  8.25,37.75 0 top
R3  741X163103JP - 10K  [SMD''''']  43.75,37.75 0 top
R4  EXB-2HV680JV - 68 Ohm  [SMD''''']  26.75,40 0 top
R5  9.75,20.5 270 top
R6  46,41 90 top
R7  32.5,37.5 270 top
R8  31.5,12 270 top
R9  30.25,12 90 top
ROTARY  52793-0570  [SMD'''']  41.5,54.25 90 top
UP  SKRKAEE020  [SMD']  26,17.85 0 bottom

### Tracks (layer width: path | path; a pad name or v marks a point on that pad's centre or on a via)
3V3  (via drill 0.35)
  Top 0.3: 43.75,38.33 R3.P$13 R3.P$14 R3.P$15 R3.P$16 | 43.75,38.33 R3.P$12 R3.P$11 R3.P$10 R3.P$9 | R2.P$16 R2.P$15 R2.P$14 R2.P$13 8.25,38.33 | 8.25,38.33 R2.P$12 R2.P$11 R2.P$10 R2.P$9 | v43.75,39.25 43.75,38.33 | IC1.VCC 13.33,35.68 C12.2 13.6,35.75 v14.5,35.75 | 8.25,38.33 v8.25,39.25 | IC2.VCC 40.23,28.68 C13.2 v40.25,28.75 | v27,17.25 27.25,17.5 MCU.7_3V3 | LCD.1_IRS 19,56.25 19.5,56.75 28.5,56.75 29,56.25 LCD.21_DB4 | LCD.21_DB4 LCD.20_DB5 28.5,53.5 | LCD.21_DB4 LCD.22_DB3 LCD.23_DB2 LCD.24_DB1 LCD.25_DB0 LCD.26_!RD(E)! LCD.27_R/W(!WR!) | v41.25,45.74 v41.25,45.75 41.25,44.83 J1.3 | 3V3.P$1 v16.5,17 | R5.1 9.67,21.92 v9.5,21.75 | R6.1 v46,39.75 | C1.+ C11.+ 31.75,52.75 31,53.5 28.5,53.5 | LCD.17_VDD 27,53.99 27.49,53.5 28.5,53.5
  Bottom 0.3: LED14.A 50.45,48.25 v49.5,48.25 | LED7.A 1.55,40.75 v2.5,40.75 | v2.5,49.75 1.55,49.75 LED11.A | v49.5,39.25 50.45,39.25 LED17.A
  other vias: 15,42 34,51.5
  pour Route15 (isolate 0.406): 0,73.8 52,73.8 52,0 0,0
ALT_IN  (via drill 0.35)
  Top 0.3: IC1.IN4 3.58,33.08 v3.5,33
  Route2 0.4: v3.5,33 5,31.5 5,22.75 9,18.75 30,18.75 31.75,17 35.75,17 36.25,16.5 36.25,13.75 36.75,13.25 40.75,13.25 41.26,12.74 v41.26,8
  Bottom 0.3: ALT.2 v41.26,8
ALT_OUT
  Top 0.3: R2.P$5 8.5,35.25 10.67,33.08 IC1.OUT4 18.33,33.08 20.75,35.5 IC5.PC13_1
CAP1+  (via drill 0.35)
  Top 0.3: LCD.12_CAP1+ v24.5,56 | C8.1 v26.75,49.25
  Route2 0.4: v26.75,49.25 24.5,51.5 v24.5,56
CAP1-
  Top 0.3: C9.1 C8.2 26.75,51.5 25,53.25 LCD.13_CAP1-
CAP2+  (via drill 0.35)
  Top 0.3: v23.5,56 23.53,56 24,55.53 LCD.11_CAP2+ | C10.1 v25.5,49.25
  Route2 0.4: v25.5,49.25 23.5,51.25 v23.5,56
CAP2-
  Top 0.3: LCD.10_CAP2- 23.5,53.5 25.5,51.5 C10.2
CAP3+  (via drill 0.35)
  Top 0.3: LCD.14_CAP3+ v25.5,56 | C9.2 v28,49.25
  Route2 0.4: v28,49.25 25.5,51.75 v25.5,56
CP1  (via drill 0.35)
  Top 0.3: v26.5,42.25 R4.P$13 | v28.25,23.5 28.25,23 28.5,22.75 35,22.75 36.75,24.5 v40.75,24.5
  Route2 0.4: v24.75,24.5 26,24.5 27,23.5 v28.25,23.5 | v40.75,24.5 41.75,24.5 42.75,23.5 v43.5,23.5
  Route15 0.4: v8.5,15.25 9.5,15.25 10.5,16.25 v11.25,16.25 13.75,16.25 22,24.5 v24.75,24.5
  Bottom 0.3: LED1.G_C 43.4,23.6 v43.5,23.5 | LED1.R_A 40.85,24.4 v40.75,24.5 | v28.25,23.5 28.15,23.6 LED20.G_C | LED20.R_A 24.85,24.4 v24.75,24.5 24.75,25.75 25.5,26.5 25.5,27.75 26.5,28.75 26.5,32.11 26.88,32.49 26.88,33.01 26.5,33.39 v26.5,42.25 | v8.5,15.25 8.54,15.29 LED22.G_A | LED22.R_C 11.09,16.09 v11.25,16.25
CP2  (via drill 0.35)
  Top 0.3: v28.5,42.25 27.5,41.25 R4.P$11
  Route2 0.4: v43.5,15.25 42.75,15.25 41.75,16.25 v40.75,16.25 v40.75,23.5
  Route15 0.4: v28.5,42.25 28.5,39.25 29,38.75 29,38.25 28.5,37.75 28.5,29.25 31.5,26.25 32,26.25 32.5,25.75 32.5,25 34,23.5 v40.75,23.5 41.75,23.5 42.75,24.5 v43.5,24.5
  Bottom 0.3: LED2.R_A 40.9,16.1 v40.75,16.25 | LED2.G_C 43.45,15.3 v43.5,15.25 | LED1.R_C 43.4,24.4 v43.5,24.5 | LED1.G_A 40.85,23.6 v40.75,23.5
CP3  (via drill 0.35)
  Top 0.3: v25.5,42.25 26,41.75 R4.P$14
  Route2 0.4: v8.5,24.5 9.25,24.5 10.25,23.5 v11.25,23.5 v24.75,23.5 | v44.75,5.25 44,5.25 43,6.25 v42.25,6.25 42.25,14.25 41.25,15.25 v40.75,15.25 40.25,15.25 37.75,17.75 32,17.75 29,20.75 29,23.75 v28.25,24.5
  Route15 0.4: v24.75,23.5 26,23.5 27,24.5 v28.25,24.5 | v40.75,15.25 41.75,15.25 42.75,16.25 v43.5,16.25
  Bottom 0.3: LED3.R_A v42.25,6.25 | LED3.G_C 44.55,5.45 v44.75,5.25 | v40.75,15.25 40.8,15.3 LED2.G_A | v43.5,16.25 43.35,16.1 LED2.R_C | LED20.R_C 28.15,24.4 v28.25,24.5 | LED20.G_A 24.85,23.6 v24.75,23.5 | LED21.G_C 11.15,23.6 v11.25,23.5 17.71,23.5 25.5,31.29 v25.5,42.25 | LED21.R_A 8.6,24.4 v8.5,24.5
CP4  (via drill 0.35)
  Top 0.3: v27.5,42.25 27,41.75 R4.P$12
  Route2 0.4: v24.75,16.25 25.5,16.25 26.5,15.25 v27.25,15.25 28.25,15.25 38.25,5.25 v42.25,5.25
  Route15 0.4: v42.25,5.25 43,5.25 44,6.25 v44.75,6.25 | v27.25,15.25 29,15.25 31,17.25 31,25.75 27.5,29.25 v27.5,42.25
  Bottom 0.3: LED3.G_A 42.45,5.45 v42.25,5.25 | v44.75,6.25 LED3.R_C | v24.75,16.25 24.9,16.1 LED4.R_A | LED4.G_C 27.2,15.3 v27.25,15.25
CP5  (via drill 0.35)
  Top 0.3: v24.5,42.25 25.5,41.25 R4.P$15
  Route2 0.4: v8.5,16.25 9.25,16.25 10.25,15.25 v11.25,15.25 v24.75,15.25
  Route15 0.4: v11.25,24.5 10.5,24.5 9.5,23.5 v8.5,23.5 v8.5,16.25 | v24.75,15.25 25.5,15.25 26.5,16.25 v27.25,16.25
  Bottom 0.3: LED21.R_C 11.15,24.4 v11.25,24.5 18,24.5 24.5,31 v24.5,42.25 | LED21.G_A 8.6,23.6 v8.5,23.5 | v11.25,15.25 11.21,15.29 LED22.G_C | LED22.R_A 8.66,16.09 v8.5,16.25 | v24.75,15.25 24.8,15.3 LED4.G_A | LED4.R_C 27.1,16.1 v27.25,16.25
DOWN_IN  (via drill 0.35)
  Top 0.3: IC1.IN7 6.12,31.13 v6.5,30.75
  Route2 0.4: v6.5,30.75 17.25,30.75 22.75,25.25 28.5,25.25 29.75,24 29.75,21 32.25,18.5 39.3,18.5 v39.95,17.84
  Bottom 0.3: DOWN.2 v39.95,17.84
DOWN_OUT
  Top 0.3: R2.P$2 7,34.5 10.37,31.13 IC1.OUT7 18.62,31.13 20.25,29.5 21.95,29.5 22.45,30 IC5.PA1_12
ENT_IN  (via drill 0.35)
  Top 0.3: IC1.IN8 3.52,30.48 v3.5,30.5
  Route2 0.4: v3.5,30.5 3.5,22 v7.66,17.84
  Bottom 0.3: ENT.2 v7.66,17.84
ENT_OUT
  Top 0.3: R2.P$1 6.5,34.25 10.27,30.48 IC1.OUT8 18.52,30.48 20.05,28.95 23.5,28.95 IC5.PA2_13
ESC_IN  (via drill 0.35)
  Top 0.3: IC1.IN2 3.63,34.38 v3.5,34.25
  Route2 0.4: v3.5,34.25 5.75,32 5.75,28.25 7.79,26.2 v7.79,26.13
  Bottom 0.3: ESC.2 7.78,26.15 v7.79,26.13
ESC_OUT
  Top 0.3: R2.P$7 9.5,35.75 10.87,34.38 IC1.OUT2 18.13,34.38 20.5,36.75 21.25,36.75 21.75,37.25 23.75,37.25 24,37 IC5.47_PB8
FN1_IN  (via drill 0.35)
  Top 0.3: PTT.3 v37,15 | IC2.IN5 48.43,33.07 v48.5,33
  Bottom 0.3: v37,15 37.5,15 38.25,15.75 38.25,28.5 41.5,31.75 47.5,31.75 48.5,32.75 v48.5,33
FN1_OUT
  Top 0.3: R3.P$4 43.5,35.25 41.32,33.07 IC2.OUT5 39.12,33.07 38.55,32.5 IC5.30_PC6
FN2_IN  (via drill 0.35)
  Top 0.3: PTT.2 v37,14 | IC2.IN3 48.48,31.77 v48.5,31.75
  Bottom 0.3: v48.5,31.75 48,31.25 41.75,31.25 38.75,28.25 38.75,15.25 37.5,14 v37,14
FN2_OUT
  Top 0.3: 40,31.77 IC2.OUT3 | IC2.OUT3 41.52,31.77 44.5,34.75 R3.P$6 | IC2.OUT3 39.32,31.77 39.05,31.5 IC5.28_PA8
GND  (via drill 0.35, 2 pad 4)
  Top 0.3: LCD.2_P/S 19.5,53.75 v19.75,53.5 20,53.75 LCD.3_C86 | IC5.VSS/VSSA_7 26,32.5 IC5.VSS | 35.05,56.05 v35,56
  other vias: 4.2,4.35 32.25,4.35 26,67 26,2 16,67 2,29 40,45.75 2,19 36,2 50,19 50,9 2,47 2,57 36,67 50,47 50,57 46,2 16,2 6,2 2,9 46,67 6,67 50,29 41.25,27 13.5,37.25 6.5,29.5 17.25,42.25 19.5,42.25 21,16.25 34,13 26.25,32.75 29.5,42.25 34.5,37 30.25,28.75 38.25,54.25 38.25,52.25 19.5,31.75 40,22.25 7.75,24 50,38 2,38 2,64 50,64 31,16.25 36,9.75 36,20.25 17.5,56 14.25,8.25 22.75,39.5 34,48.5 31.75,48.5 5.4,71.45 46.6,71.45
  pour Top: 0,73.8 52,73.8 52,0 0,0
  pour Bottom: 0,73.8 52,73.8 52,0 0,0
  pour Route2 (isolate 0.406): 0,73.8 52,73.8 52,0 0,0
GR_IN  (via drill 0.35)
  Top 0.3: IC1.IN5 6.07,32.43 v6.5,32
  Route2 0.4: v6.5,32 7,31.5 17.5,31.5 22.88,26.12 v23.8,26.12
  Bottom 0.3: GR.2 23.88,26.12 v23.8,26.12
GR_OUT
  Top 0.3: R2.P$4 8,35 10.57,32.43 IC1.OUT5 18.43,32.43 21,35 IC5.PC14_OSC32_IN_2
IMIC+  (via drill 0.35)
  Top 0.25: IMIC.P$2 v11.75,54.25
  Top 0.3: MCU.4_IMIC+ 28.75,14.75 26.5,12.5 v6.5,12.5 | IMIC.P$2 12.27,55 13.75,55 C14.2 13.85,55
  Bottom 0.25: v11.75,54.25 8,54.25 5.22,51.48 5.22,29.73 4.72,29.23 4.72,13.78 6,12.5 v6.5,12.5
IMIC-  (via drill 0.35)
  Top 0.25: 12.27,56.5 IMIC.P$1 v11.75,57
  Top 0.3: C14.1 13.75,56.5 12.27,56.5 | MCU.5_IMIC- 28.25,15 26.75,13.5 v6.5,13.5
  Bottom 0.25: v11.75,57 12.5,56.25 12.5,54 12,53.5 8,53.5 5.75,51.25 5.75,29.5 5.25,29 5.25,14.25 6,13.5 v6.5,13.5
IR_ANODE  (via drill 0.35)
  Top 0.3: R6.2 v46,42.25
  Route2 0.4: v46,42.25 46.25,42.5 v49.5,42.5
  Bottom 0.3: v2.5,52.75 LED12.A | LED6.A v2.5,43.5 3,43.5 3.25,43.75 3.25,52.75 v2.5,52.75 | LED9.A v49.5,42.5 49,42.5 48.75,42.75 48.75,51.75 | LED16.A v49.5,51.75 48.75,51.75 | 48.75,51.75 42.25,58.25 5.5,58.25 2.5,55.25 v2.5,52.75
KEYPAD_BACKLIGHT_IR_GATE
  Top 0.3: IC5.PB1_20 27,26.96 27.88,26.08 27.88,25.75 28.18,25.45 IC4.1_G1
KEYPAD_IR_LED_A  (via drill 0.35)
  Top 0.3: R5.2 9.75,19.25 v9.5,19.5
  Route2 0.4: v9.5,19.5 9.75,19.75 23.5,19.75 v23.75,20
  Route15 0.4: v23.75,20 27.75,20 30.25,22.5 30.25,25.5 28,27.75 v23.75,27.75
  Bottom 0.3: 24.86,19.75 LED18.A 24.52,19.73 24.25,20 v23.75,20 23.25,20 23,19.75 23,14.75 25.5,12.25 39.25,12.25 | LED15.A 8.7,28 7.5,28 7,27.5 7,22.25 8.73,20.52 LED5.A 9.23,19.73 9.46,19.5 v9.5,19.5 | LED8.A 40.99,28 39.75,28 39.25,27.5 39.25,19.75 | LED19.A 42.53,10 42,10 41.5,10.5 39.25,10.5 39.25,12.25 | 39.25,19.75 39.25,12.25 | LED13.A 41.01,19.75 39.25,19.75 | LED10.A 24.84,28 24,28 v23.75,27.75
KEYPAD_IR_LED_DRAIN  (via drill 0.35)
  Top 0.3: IC4.6_D1 v31.75,25.5
  Route15 0.4: v42,21.25 42,20.25 40.75,19 33,19 31.75,20.25 v31.75,25.5
  Bottom 0.3: LED15.C 10.97,27.22 10.15,26.4 10.15,25.15 9.9,24.9 9.9,23.1 10.15,22.85 10.15,21.75 | LED5.C 10.95,19.75 10.5,19.75 10.15,20.1 10.15,21.75 | LED10.C 27.09,28 26.5,28 26.05,27.55 26.05,21.75 | 26.05,21.75 26.05,20.2 26.52,19.73 LED18.C | LED8.C 43.24,28 42.5,28 42.1,27.6 42.1,21.85 42,21.75 v42,21.25 42,20.75 42.2,20.55 42.2,19.75 | 26.05,21.75 28.5,21.75 31.75,25 v31.75,25.5 | LED19.C 44.77,10.61 42.2,13.18 42.2,19.75 | 26.05,21.75 10.15,21.75 | LED13.C 43.25,19.75 42.2,19.75
LCD_!D!/C  (via drill 0.35)
  Top 0.3: LCD.28_A0(RS) v32.5,56
LCD_BACKLIGHT_GREEN_DRAIN  (via drill 0.35)
  Top 0.3: IC3.6_D1 35.45,28.55 v35.25,28.75
  Route2 0.4: v2.5,48.25 2,48.25 0.75,47 0.75,40.5 2,39.25 v2.5,39.25 3,39.25 4.5,40.75 v43.75,40.75 v49.5,40.75 50,40.75 51.25,42 51.25,48.5 50,49.75 v49.5,49.75
  Bottom 0.3: v43.75,40.75 43.25,40.75 35.25,32.75 v35.25,28.75 | v49.5,49.75 50.45,49.75 LED14.C | LED11.C 1.55,48.25 v2.5,48.25 | v2.5,39.25 1.55,39.25 LED7.C | v49.5,40.75 50.45,40.75 LED17.C
LCD_BACKLIGHT_GREEN_GATE
  Top 0.3: IC3.1_G1 35.45,30.75 35.2,31 IC5.27_PB15
LCD_BACKLIGHT_IR_DRAIN  (via drill 0.35)
  Top 0.3: v33.75,28.75 33.55,28.55 IC3.4_D2
  Route2 0.4: 3.75,44.75 v33.25,44.75 48.25,44.75 | v49.5,52.75 49,52.75 48.25,52 48.25,44.75 | v2.5,51.75 3,51.75 3.75,51 3.75,44.75 | v2.5,42.5 3,42.5 3.75,43.25 3.75,44.75 | v49.5,43.5 49,43.5 48.25,44.25 48.25,44.75
  Bottom 0.3: v33.25,44.75 33.75,44.25 v33.75,28.75 | v2.5,51.75 LED12.C | v2.5,42.5 LED6.C | LED9.C v49.5,43.5 | v49.5,52.75 LED16.C
LCD_BACKLIGHT_IR_GATE
  Top 0.3: IC5.26_PB14 33.25,30.5 33.55,30.2 IC3.3_G2
LCD_RST  (via drill 0.35)
  Top 0.3: v33.5,56 33.44,56 33,55.56 LCD.29_!RET! 33,53.75 33.25,53.5 35.25,53.5 35.5,53.25 R1.2 | IC5.37_PA15 29,36.75 v29.75,37.5
  Bottom 0.3: v29.75,37.5 30.25,37.5 30.75,38 30.75,51.5 33.5,54.25 v33.5,56
MCU_KEYPAD_INTERRUPT
  Top 0.3: MCU.6_PD9 27.75,19.5 27.25,20 27.25,22.29 27.38,22.41 27.38,25.87 26.5,26.75 IC5.PB0_19
MODE_IN  (via drill 0.35)
  Top 0.3: IC1.IN3 6.02,33.73 v6.5,33.25
  Route2 0.4: v40,26 40,26.5 37,29.5 20.5,29.5 17.75,32.25 7.5,32.25 v6.5,33.25
  Bottom 0.3: MODE.2 40,26.1 v40,26
MODE_OUT
  Top 0.3: R2.P$6 9,35.5 10.77,33.73 IC1.OUT3 18.23,33.73 20.75,36.25 23.45,36.25 IC5.48_PB9
N$1  (via drill 0.35)
  other vias: 40,49
N$2  (via drill 0.35)
  other vias: 40,59.5
NRST  (via drill 0.35)
  Top 0.25: J1.12 36.21,38.15 C20.1
  Top 0.3: IC5.PF2-NRST_10 21.25,31 v21,30.75 | J1.12 36.25,40.67 v36.25,39.75
  Route2 0.4: v21,30.75 25,34.75 25,37.75 27,39.75 v36.25,39.75
OSC_IN  (via drill 0.35)
  Top 0.3: IC5.PF0_8 20.5,32 v20.25,32.25 | C16.1 13.6,25.25 v15.25,25.25 | 15.25,25.27 v15.25,25.25 | IC6.1 15.3,25.25 v15.25,25.25
  Route15 0.4: v15.25,25.25 15.25,29.75 18,32.5 20,32.5 v20.25,32.25
OSC_OUT  (via drill 0.35)
  Top 0.3: IC5.PF1_9 20.5,31.5 v20.25,31.25 | v17.75,27.25 17.75,27.23 17.68,27.23 IC6.2 19.45,27.2 C18.1
  Route15 0.4: v20.25,31.25 20.25,27.25 v17.75,27.25
PIN_CP1
  Top 0.3: IC5.42_PB3 R4.P$4
PIN_CP2
  Top 0.3: IC5.40_PD2 R4.P$6
PIN_CP3
  Top 0.3: IC5.43_PB4 R4.P$3
PIN_CP4
  Top 0.3: IC5.41_PD3 R4.P$5
PIN_CP5
  Top 0.3: IC5.44_PB5 R4.P$2
PTT_IN  (via drill 0.35)
  Top 0.3: PTT.4 v37,16 | IC2.IN6 45.78,33.72 v45.75,33.75
  Bottom 0.3: v37,16 36.5,16 36.25,16.25 36.25,17.25 37.25,18.25 37.25,29 41,32.75 44.75,32.75 v45.75,33.75
PTT_OUT
  Top 0.3: R3.P$3 43,35.5 41.22,33.72 IC2.OUT6 39.02,33.72 38.3,33 IC5.31_PC7
ROTARY_A_IN  (via drill 0.35)
  Top 0.3: IC2.IN7 48.38,34.37 v48.5,34.25 | ROTARY.2 v38.25,53.25
  Route15 0.4: v38.25,53.25 38.75,53.25 47.25,44.75 47.25,37.5 48.5,36.25 v48.5,34.25
ROTARY_A_OUT
  Top 0.3: R3.P$2 42.5,35.75 41.12,34.37 IC2.OUT7 38.87,34.37 38,33.5 IC5.32_PA10
ROTARY_B_IN  (via drill 0.35)
  Top 0.3: IC1.IN1 3.97,35.03 v3.5,35.5 | ROTARY.4 v38.25,55.25
  Route15 0.4: v3.5,35.5 3.5,36 18.85,51.35 32.65,51.35 36.55,55.25 v38.25,55.25
ROTARY_B_OUT
  Top 0.3: R2.P$8 10,35.96 10.93,35.03 IC1.OUT1 18.03,35.03 20.25,37.25 21,37.25 22.5,38.75 23.75,38.75 25,37.5 IC5.45_PB6
ROTARY_PUSH_IN  (via drill 0.35)
  Top 0.3: v45.75,35 45.77,35.02 IC2.IN8 | ROTARY.5 v38.25,56.25
  Bottom 0.3: v38.25,56.25 42,56.25 47.25,51 47.25,36 46.25,35 v45.75,35
ROTARY_PUSH_OUT
  Top 0.3: R3.P$1 42,36 41.02,35.02 IC2.OUT8 38.77,35.02 37.75,34 IC5.33_PA11[PA9]
SBATT
  Top 0.3: R9.2 MCU.1_SBATT
SP_IN+  (via drill 0.35)
  Top 0.25: ISPKR.P$2 v6.25,54.25
  Top 0.3: ISPKR.P$2 6.48,54.48 7,55 8.15,55 C15.2 8.25,55 | MCU.2_SP_IN+ 29.75,14.25 26,10.5 v6.5,10.5
  Bottom 0.25: v6.25,54.25 6.25,54 4.25,52 4.25,30.25 3.75,29.75 3.75,12.75 6,10.5 v6.5,10.5
SP_IN-  (via drill 0.35)
  Top 0.25: 6.75,56.5 6.75,56.52 ISPKR.P$1 v6.25,57
  Top 0.3: 6.75,56.5 8.15,56.5 C15.1 8.25,56.5 | MCU.3_SP_IN- 29.25,14.5 26.25,11.5 v6.5,11.5
  Bottom 0.25: v6.25,57 7,56.25 7,54 4.75,51.75 4.75,30 4.25,29.5 4.25,13.25 6,11.5 v6.5,11.5
SPI_LCD_MOSI  (via drill 0.35)
  Top 0.3: LCD.18_DB7 27.5,55.75 v27.25,56 | IC5.46_PB7 24.5,37.25 23.75,38 v22.75,38
  Bottom 0.3: v22.75,38 22.25,38 21.75,38.5 21.75,49.75 23.75,51.75 25.5,51.75 27.25,53.5 v27.25,56
SPI_LCD_SCK  (via drill 0.35)
  Top 0.3: LCD.19_DB6 28,55.75 v28.25,56 | v28.25,38.5 28,38.25 IC5.39_PD1
  Bottom 0.3: v28.25,38.5 28.25,39 30.25,41 30.25,51.5 28.25,53.5 v28.25,56
SPI_LCD_SS  (via drill 0.35)
  Top 0.3: R3.P$8 45.5,36.5 45.75,36.25 v46,36.25 | IC5.38_PD0 28.5,37.25 v29.75,38.5 34,42.75 34,46.5 34.5,47 35.75,47 36.25,47.5 36.25,53.25 34.75,54.75 LCD.30_!CS1!
  Route2 0.4: v29.75,38.5 30.25,38 34.96,38 35.96,37 45.25,37 v46,36.25
SPI_MCU_MISO
  Top 0.3: MCU.9_PD11 26.25,22.7 26.38,22.83 26.38,25.37 25.5,26.25 IC5.PA6_17
SPI_MCU_MOSI
  Top 0.3: IC5.PA7_18 26,26.5 26.88,25.62 26.88,22.62 26.75,22.49 MCU.8_PD10
SPI_MCU_SCK
  Top 0.3: IC5.PA5_16 25,26 25.88,25.12 25.88,23.03 25.75,22.91 MCU.10_PD12
SPI_MCU_SS  (via drill 0.35)
  Top 0.3: IC5.PA4_15 24.5,25.75 25.38,24.87 25.38,23.24 25.25,23.11 MCU.11_PD13 v25.25,18 | R3.P$7 45,36 v45.25,35.75
  Bottom 0.3: v25.25,18 25.25,17.25 26,16.5 26,14.75 26.25,14.5 32.75,14.5 36.75,18.5 36.75,29.25 40.75,33.25 44.5,33.25 45,33.75 45,35.5 v45.25,35.75
SQL_IN  (via drill 0.35)
  Top 0.3: PTT.5 v37,17 | IC2.IN4 45.83,32.42 v45.75,32.5
  Bottom 0.3: v45.75,32.5 45.5,32.25 41.25,32.25 37.75,28.75 37.75,17.25 37.5,17 v37,17
SQL_OUT
  Top 0.3: IC5.29_PA9 38.8,32 39.22,32.42 IC2.OUT4 41.42,32.42 44,35 R3.P$5
SWDCLK  (via drill 0.35)
  Top 0.25: R7.2 32.5,35.5
  Top 0.3: IC5.36_PA14-BOOT0 32.5,35.5 37,35.5 38.5,37 39.5,37 40.02,37.52 J1.6 | MCU.12_PD14 24.75,20.5 v24.5,20.75
  Route15 0.4: v24.5,20.75 27.5,20.75 29.5,22.75 29.5,25.25 27.93,26.82 23.68,26.82 23,27.5 23,28.5 23.5,29 23.5,39.75 22.75,40.5 22.75,43 23.75,44 31.5,44 32.5,43 R7.2
  other vias: 32.5,37
SWDIO
  Top 0.3: IC5.35_PA13 37.25,35 38.62,36.38 39.88,36.38 41.29,37.79 J1.4
UP_IN  (via drill 0.35)
  Top 0.3: IC1.IN6 3.53,31.78 v3.5,31.75
  Route2 0.4: v23.8,17.84 8.81,17.84 4.25,22.41 4.25,31 v3.5,31.75
  Bottom 0.3: UP.2 v23.8,17.84
UP_OUT
  Top 0.3: R2.P$3 7.5,34.75 10.47,31.78 IC1.OUT6 18.53,31.78 21.25,34.5 21.5,34.5 IC5.PC15_OSC32_OUT_3
V0
  Top 0.3: C2.1 19.25,51.5 21,53.25 LCD.5_V0
V1
  Top 0.3: C6.1 24.25,51.5 23,52.75 LCD.9_V1
V2
  Top 0.3: LCD.8_V2 22.5,52 23,51.5 C5.1
V3
  Top 0.3: C4.1 21.75,51.5 22,51.75 LCD.7_V3
V4
  Top 0.3: C3.1 20.5,51.5 21.5,52.5 LCD.6_V4
VBAT  (via drill 0.35)
  Top 0.3: R9.1 R8.2 | v21.5,33.75 21.75,34 IC5.VBAT_4
  Bottom 0.3: v21.5,33.75 12.5,33.75 6.5,27.75 6.5,15.5 8,14 22.25,14 24.75,11.5 R9.1
  other vias: 30.25,11.5
VDD  (via drill 0.35)
  Top 0.3: C19.+ C17.+ 16.85,39.9 16.85,40 L1.1 | IC5.VDD/VDDA_6 21.75,33 v21.5,32.75
  Route2 0.4: 19.5,37.25 | 19.5,37.25 C19.+ | 19.5,37.25 19.5,34.75 v21.5,32.75
  other vias: 19.5,39.5
VOUT
  Top 0.3: C7.1 29.25,51.5 28.25,52.5 27,52.5 26,53.5 LCD.15_VOUT
WAKEUP  (via drill 0.35)
  Top 0.3: v21.75,30.25 22,30.5 IC5.PA0_11 | v11.75,29 11.75,29.8 IC1.!CH! | IC2.!CH! 40.75,35.67 v40.75,36.25
  Route2 0.4: v21.75,30.25 25.5,30.25 30.5,35.25 39.75,35.25 v40.75,36.25
  Bottom 0.3: v11.75,29 20.5,29 v21.75,30.25

### Text on the board
Top: GND | GND | GND
Route2: GND | GND | GND
Route15: 3V3 | 3V3 | 3V3
Bottom: GND | GND | GND
tPlace: - | - | + | + | GND
tStop: AN/FLC-148D LCD Panel | ejovrh
bStop: rev.1